# EAGLE schematic SIMBA_System_Control_PCB v38 (EAGLE 9.7.0), part 1 of 3
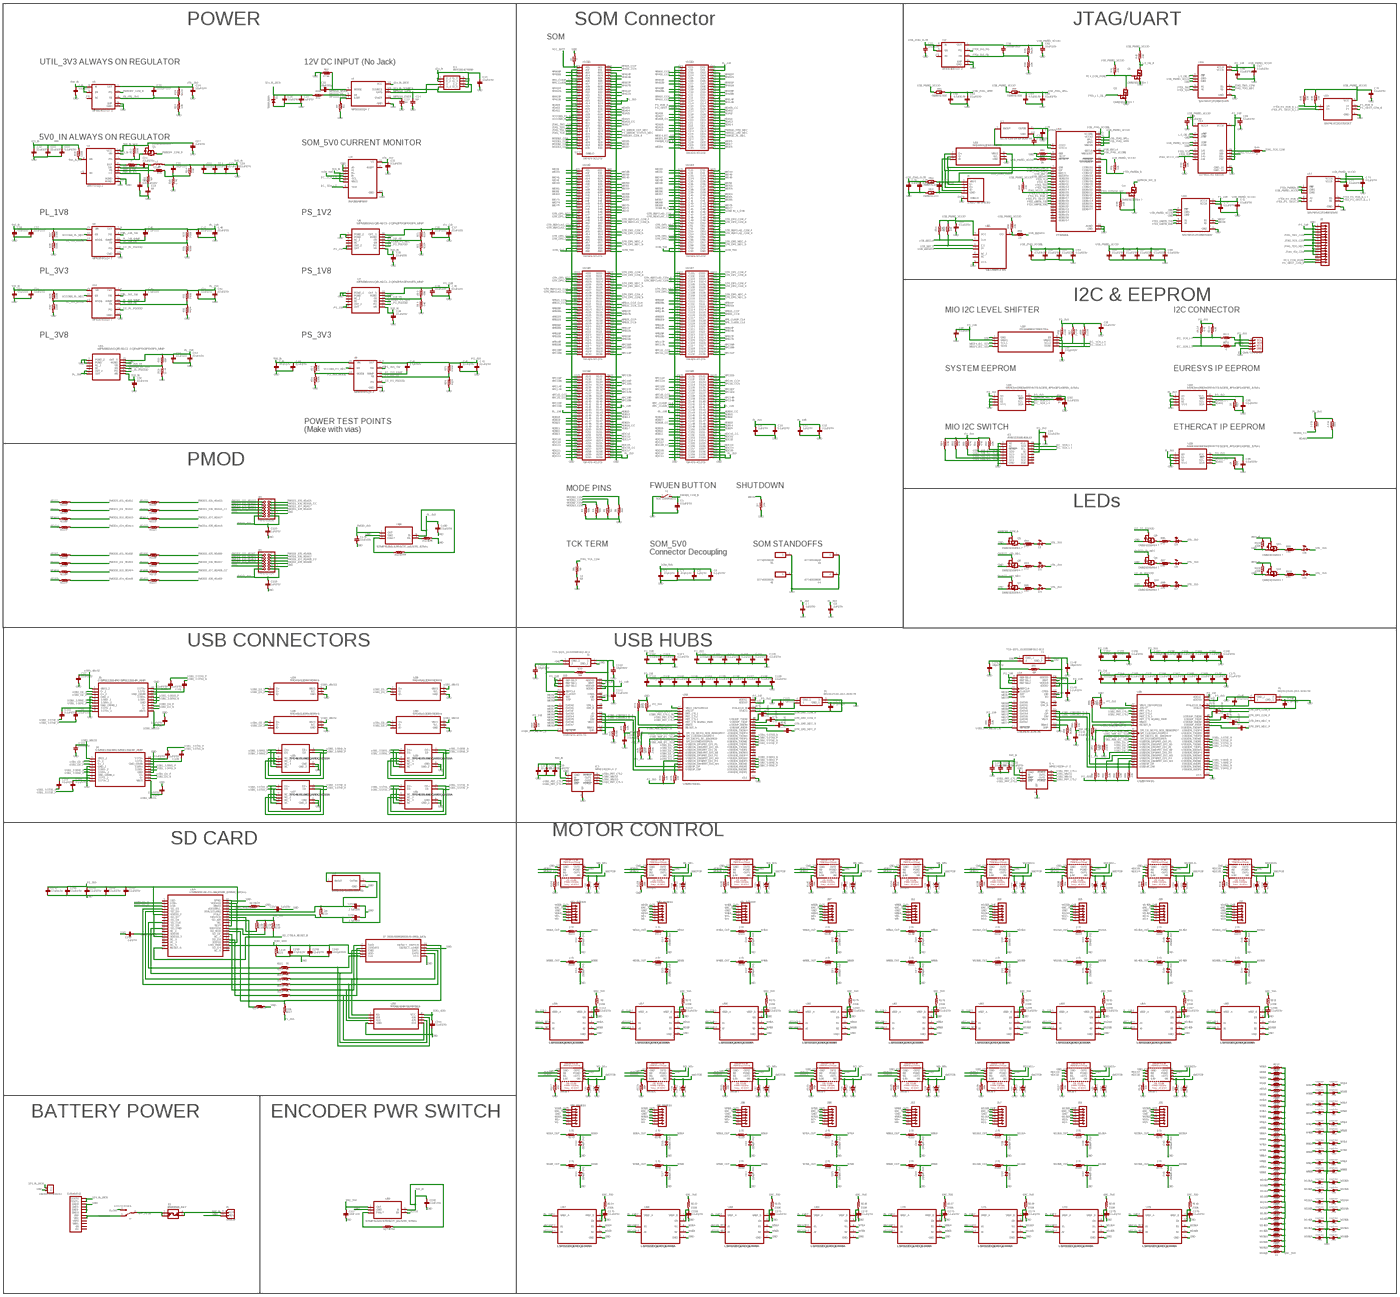
[diagram p0: schematic, sheet 1, overview]
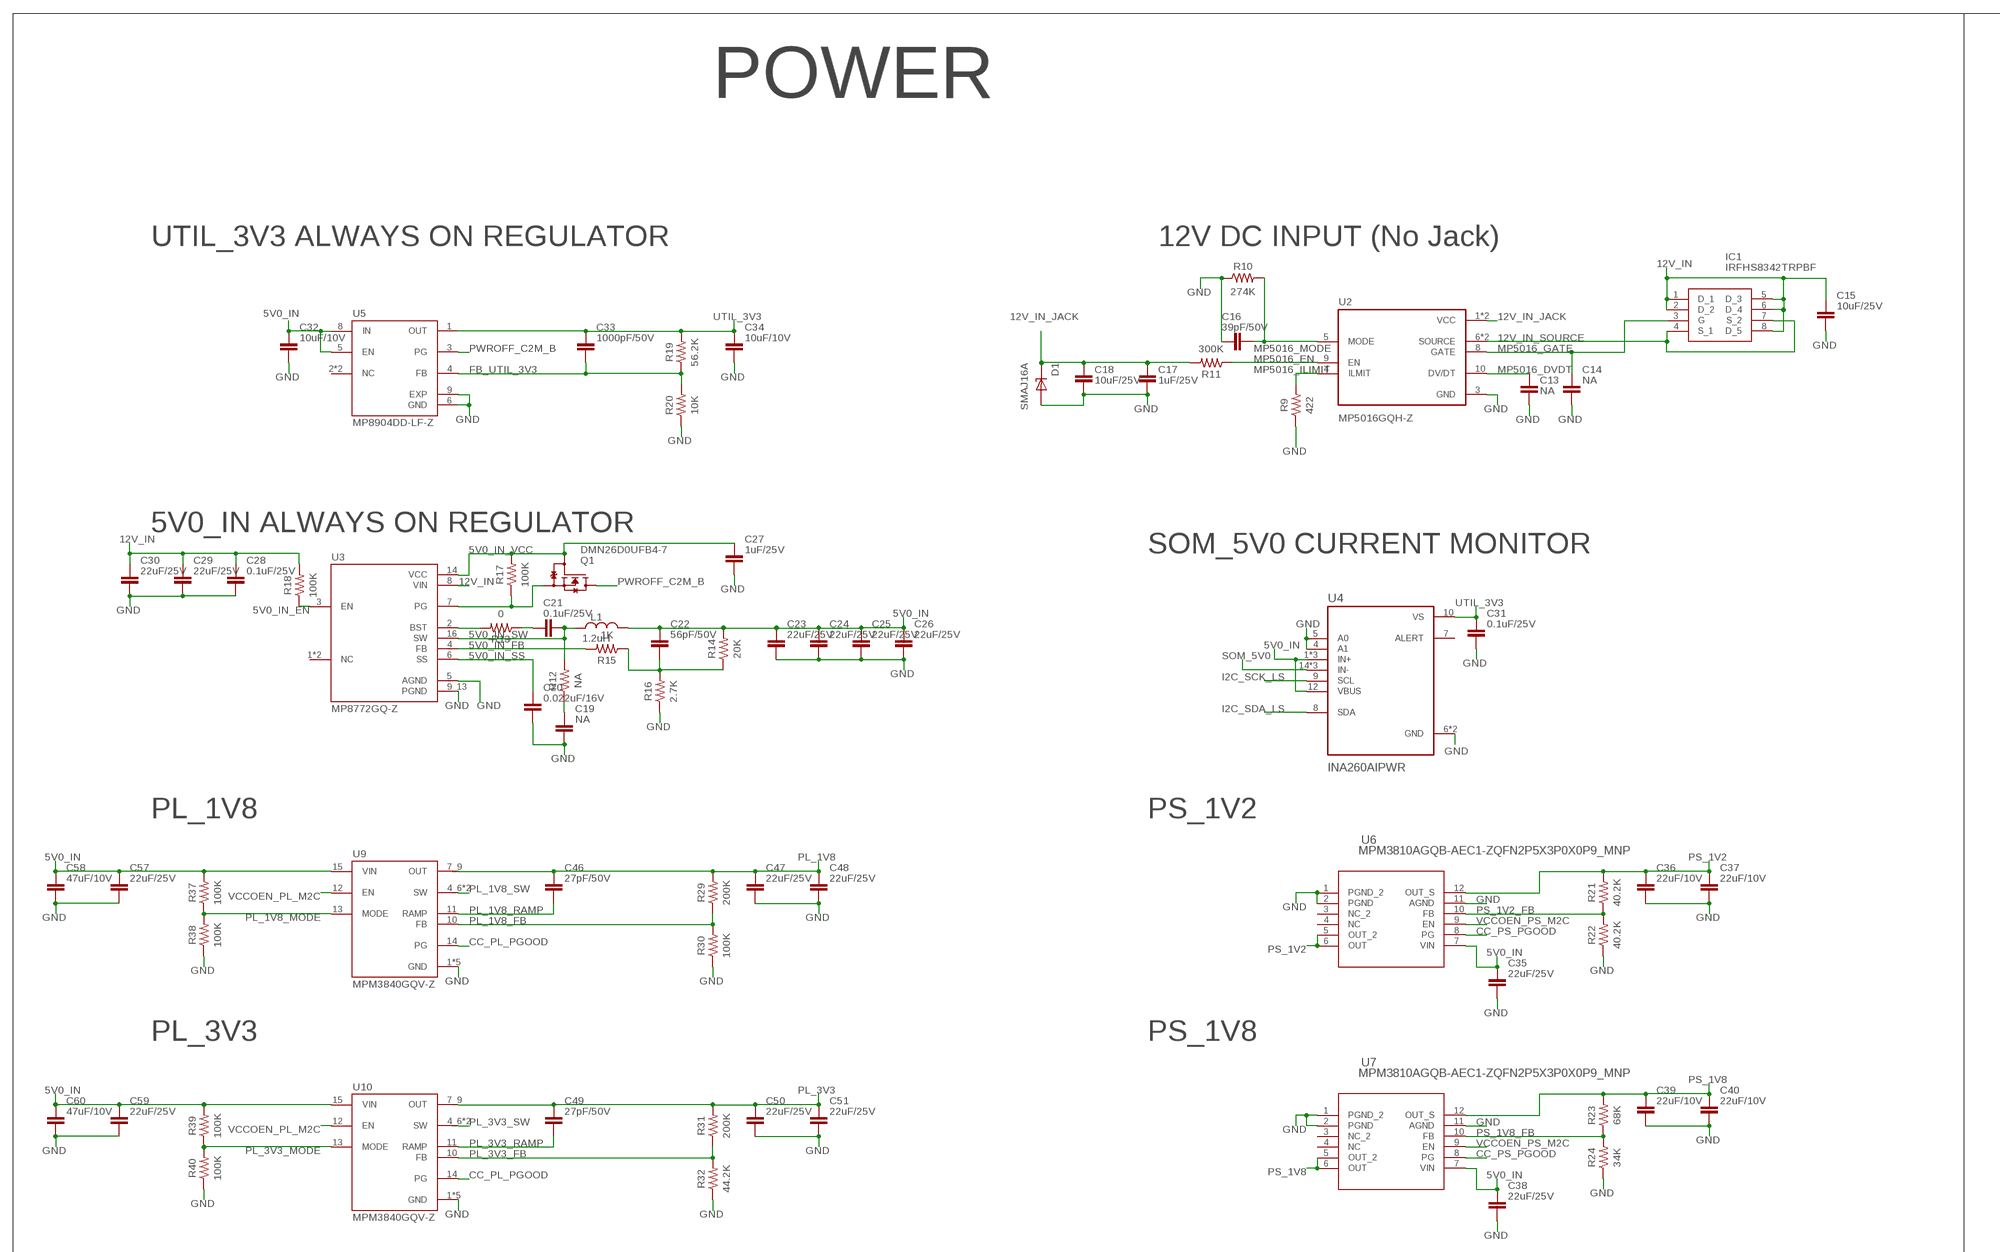
[diagram p1: schematic, sheet 1, part 1 of 9]
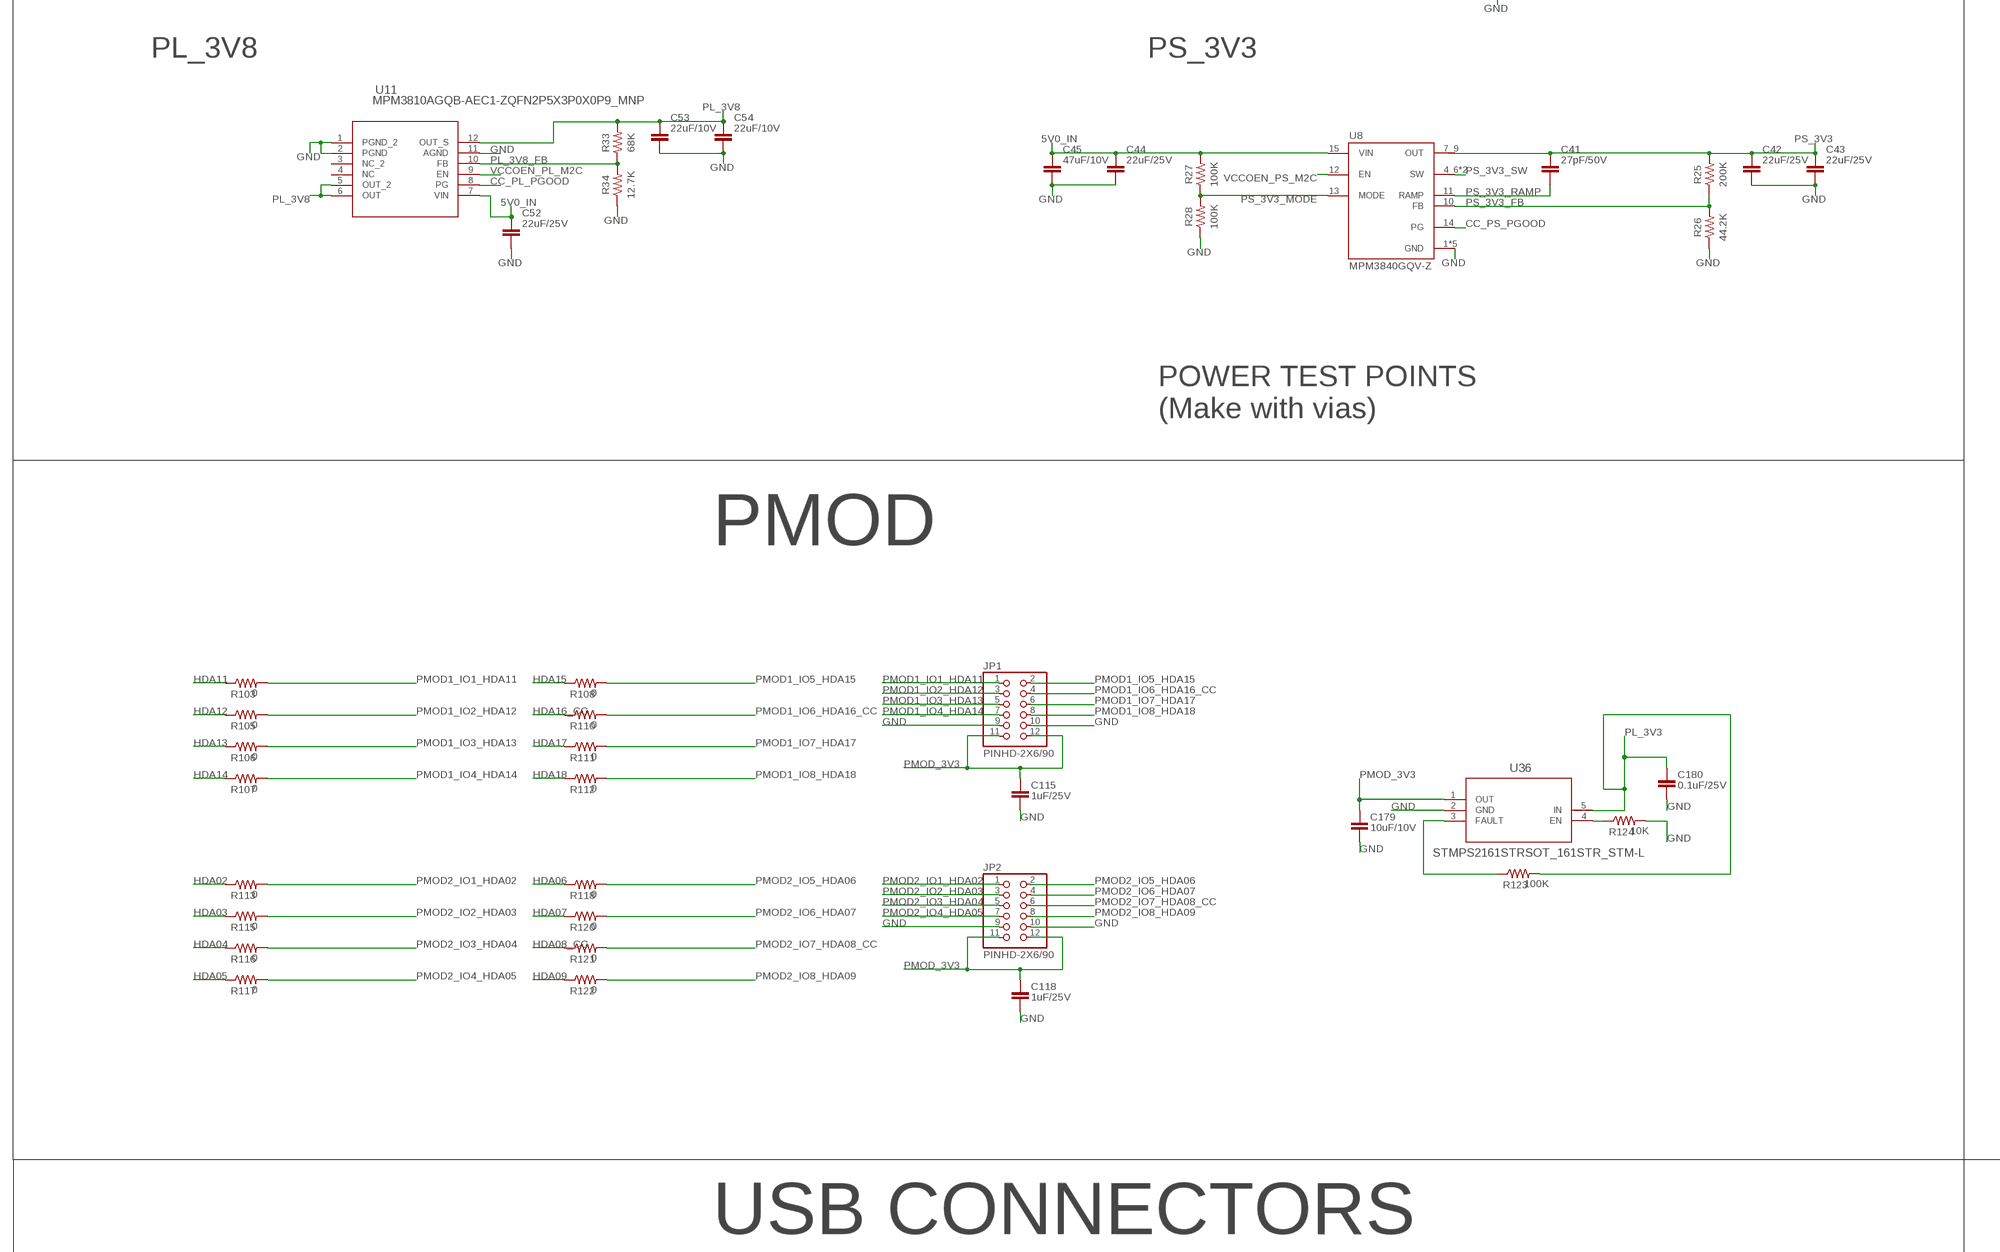
[diagram p2: schematic, sheet 1, part 2 of 9]
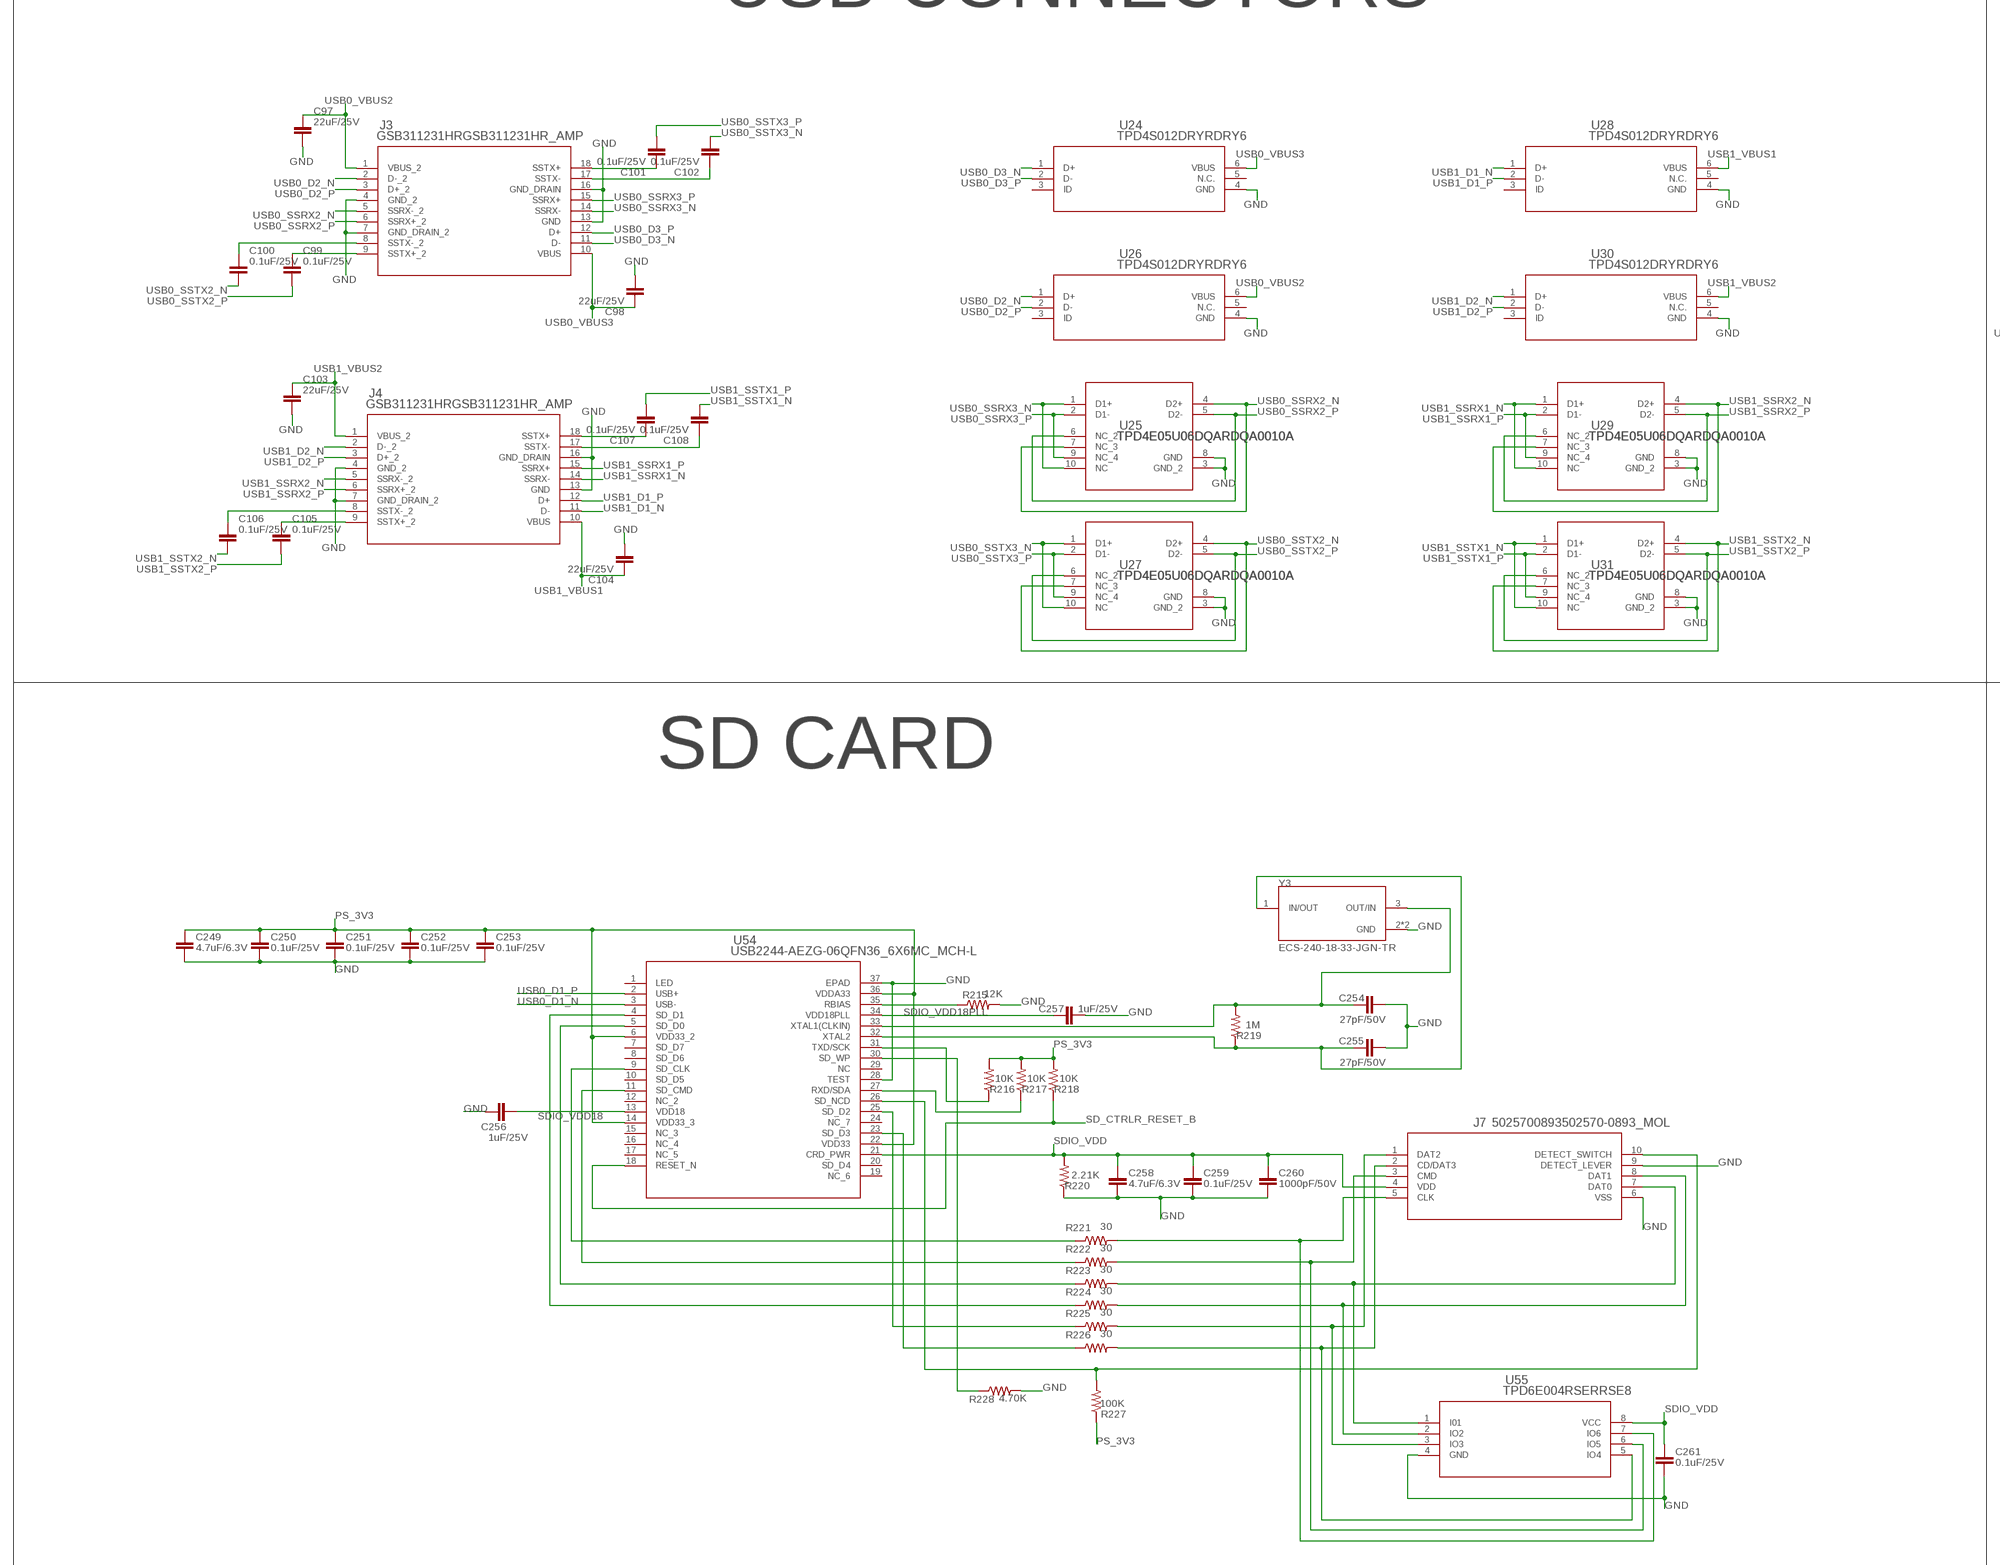
[diagram p3: schematic, sheet 1, part 3 of 9]
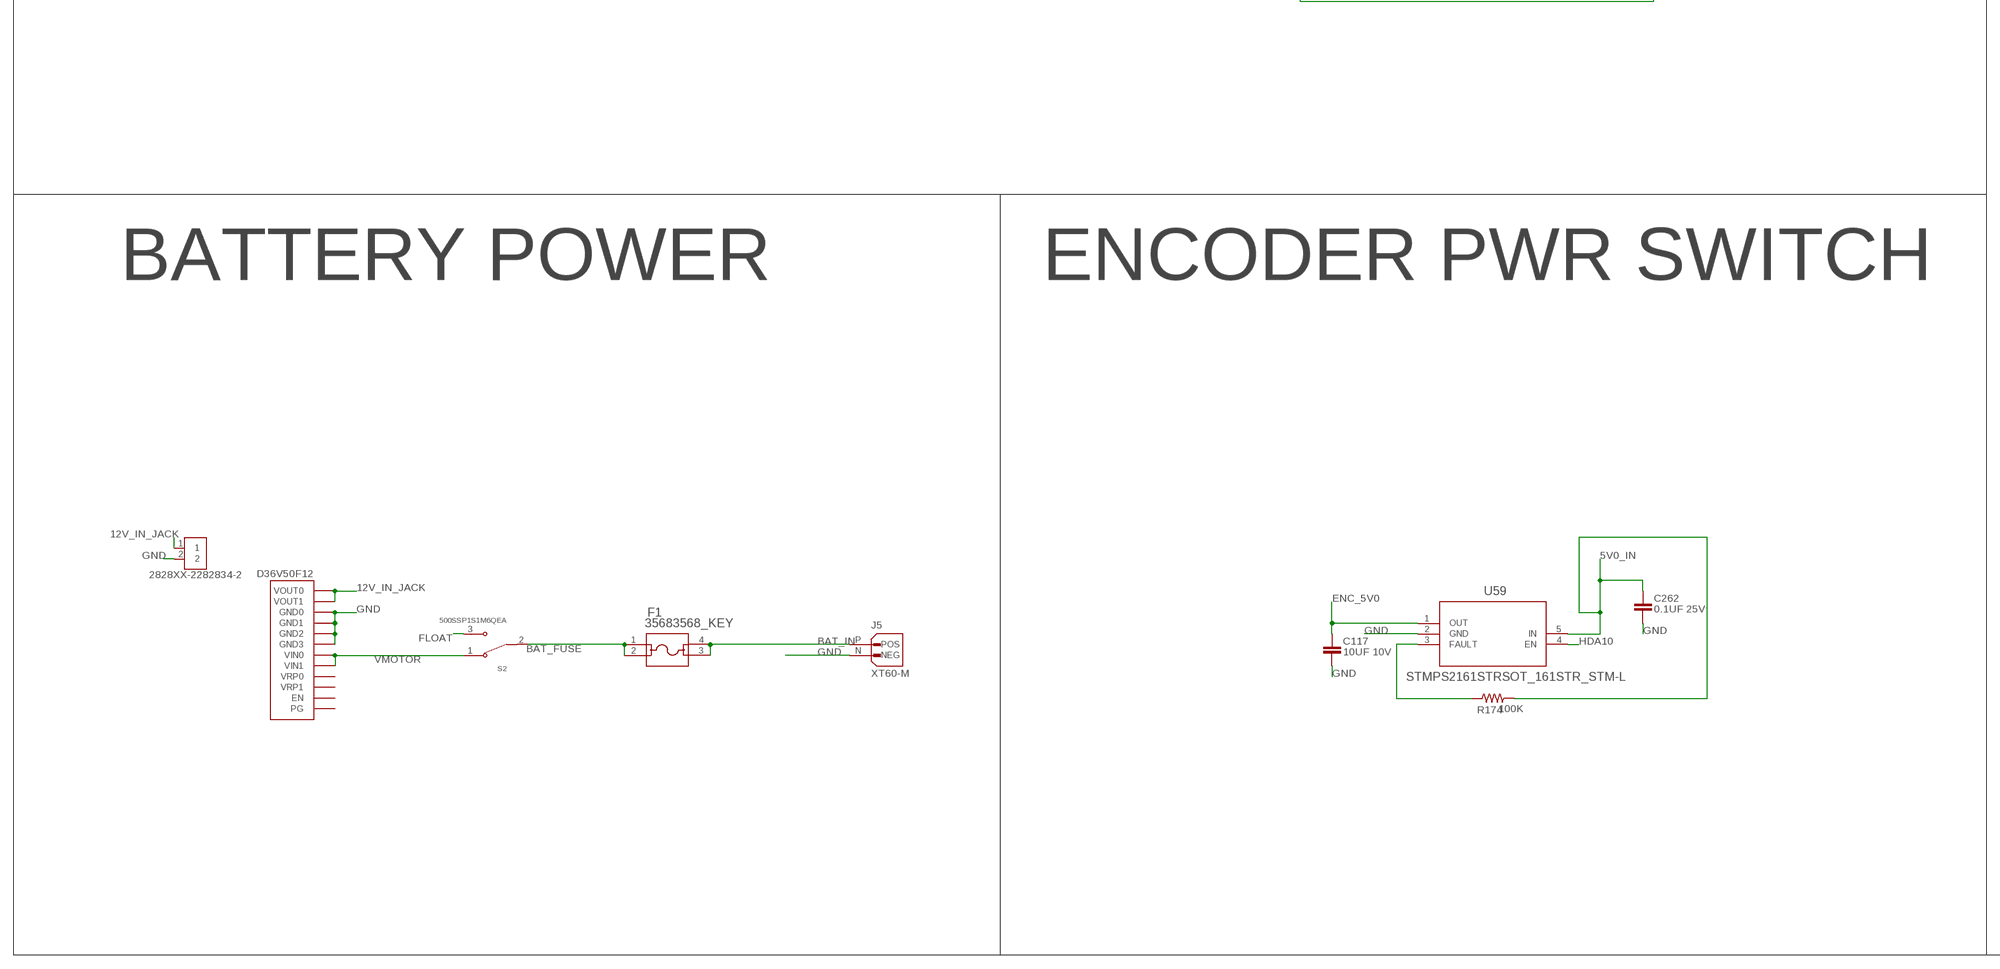
[diagram p4: schematic, sheet 1, part 4 of 9]
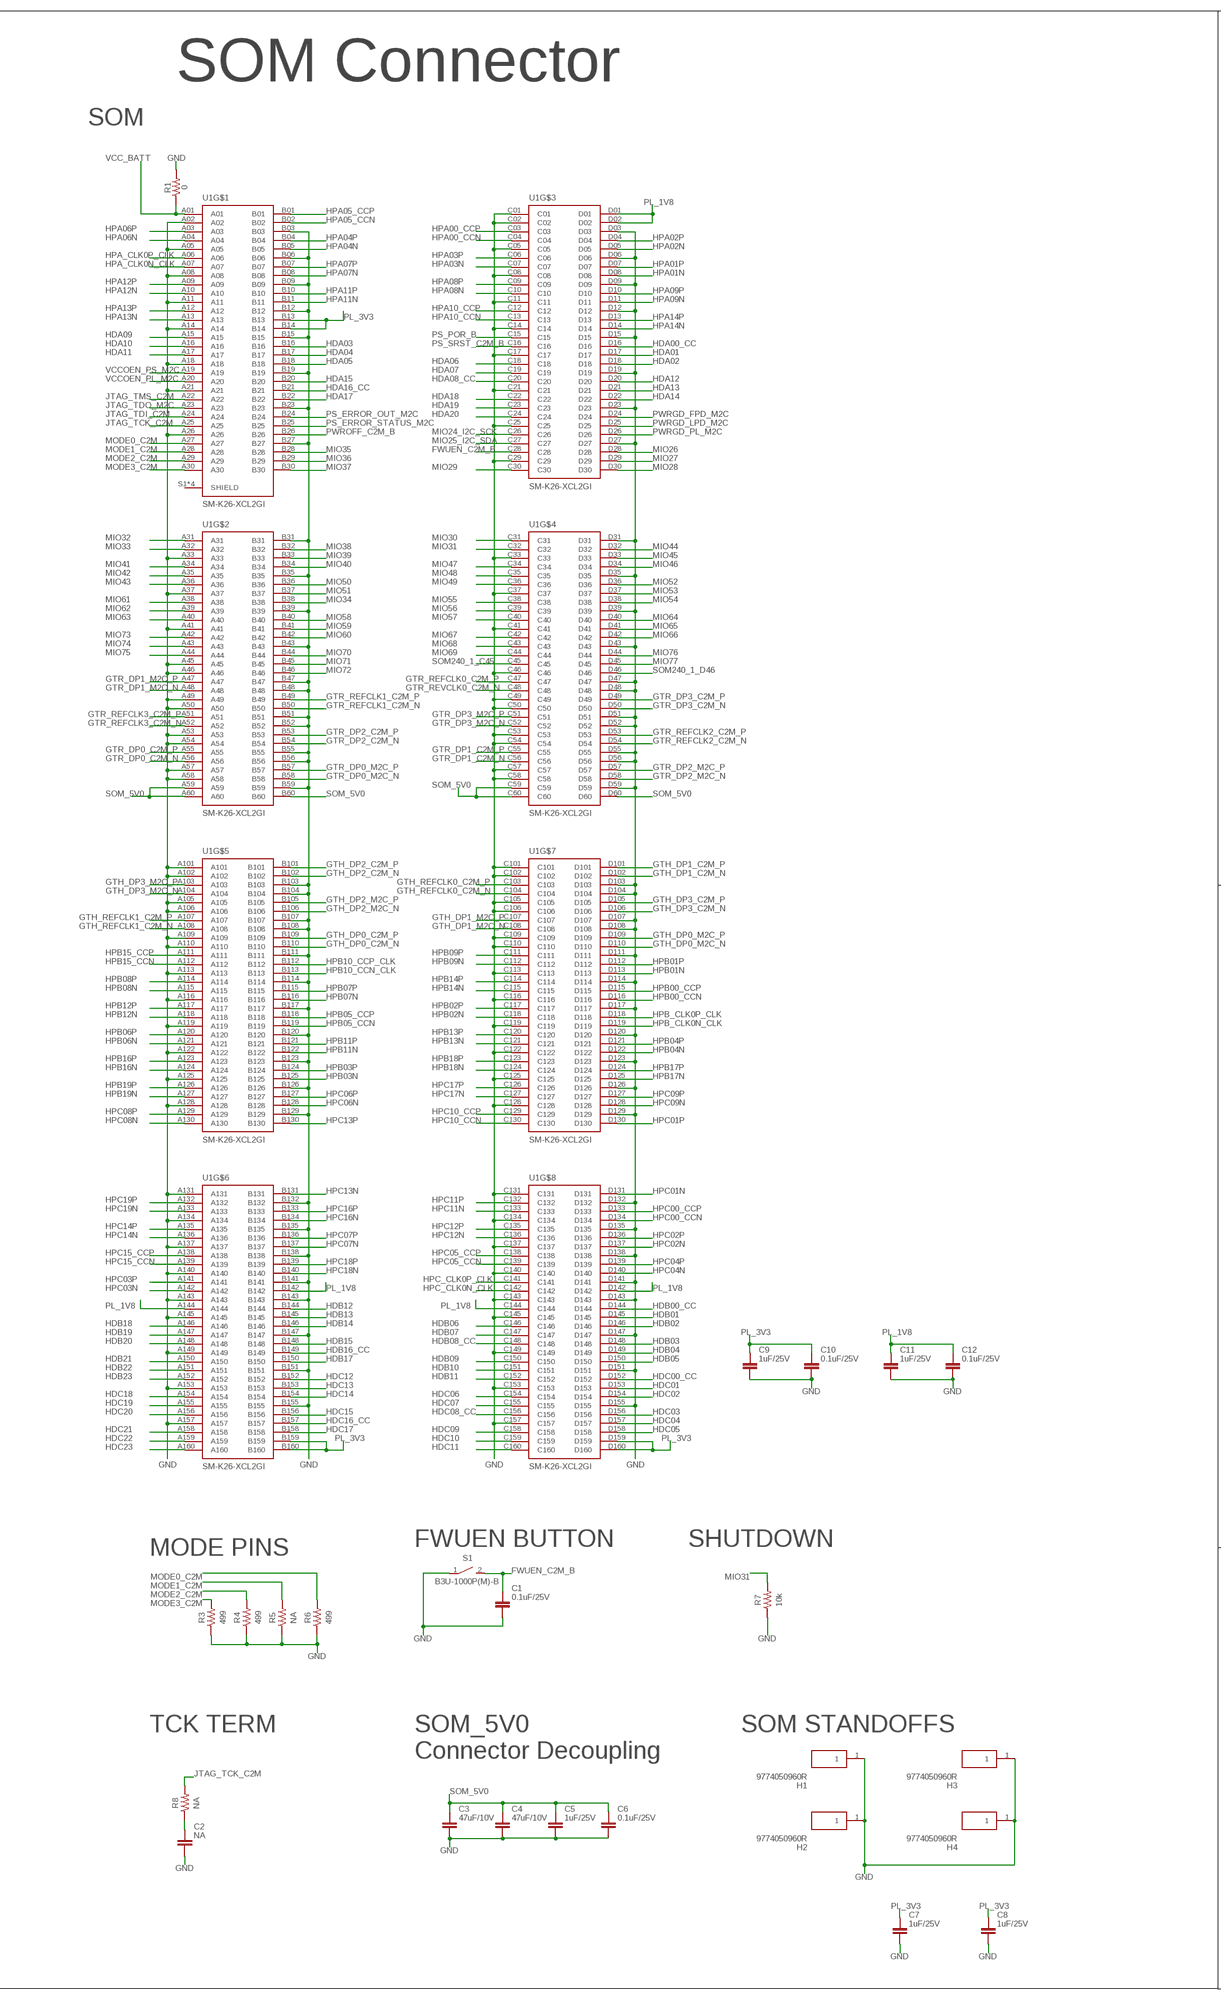
[diagram p5: schematic, sheet 1, part 5 of 9]
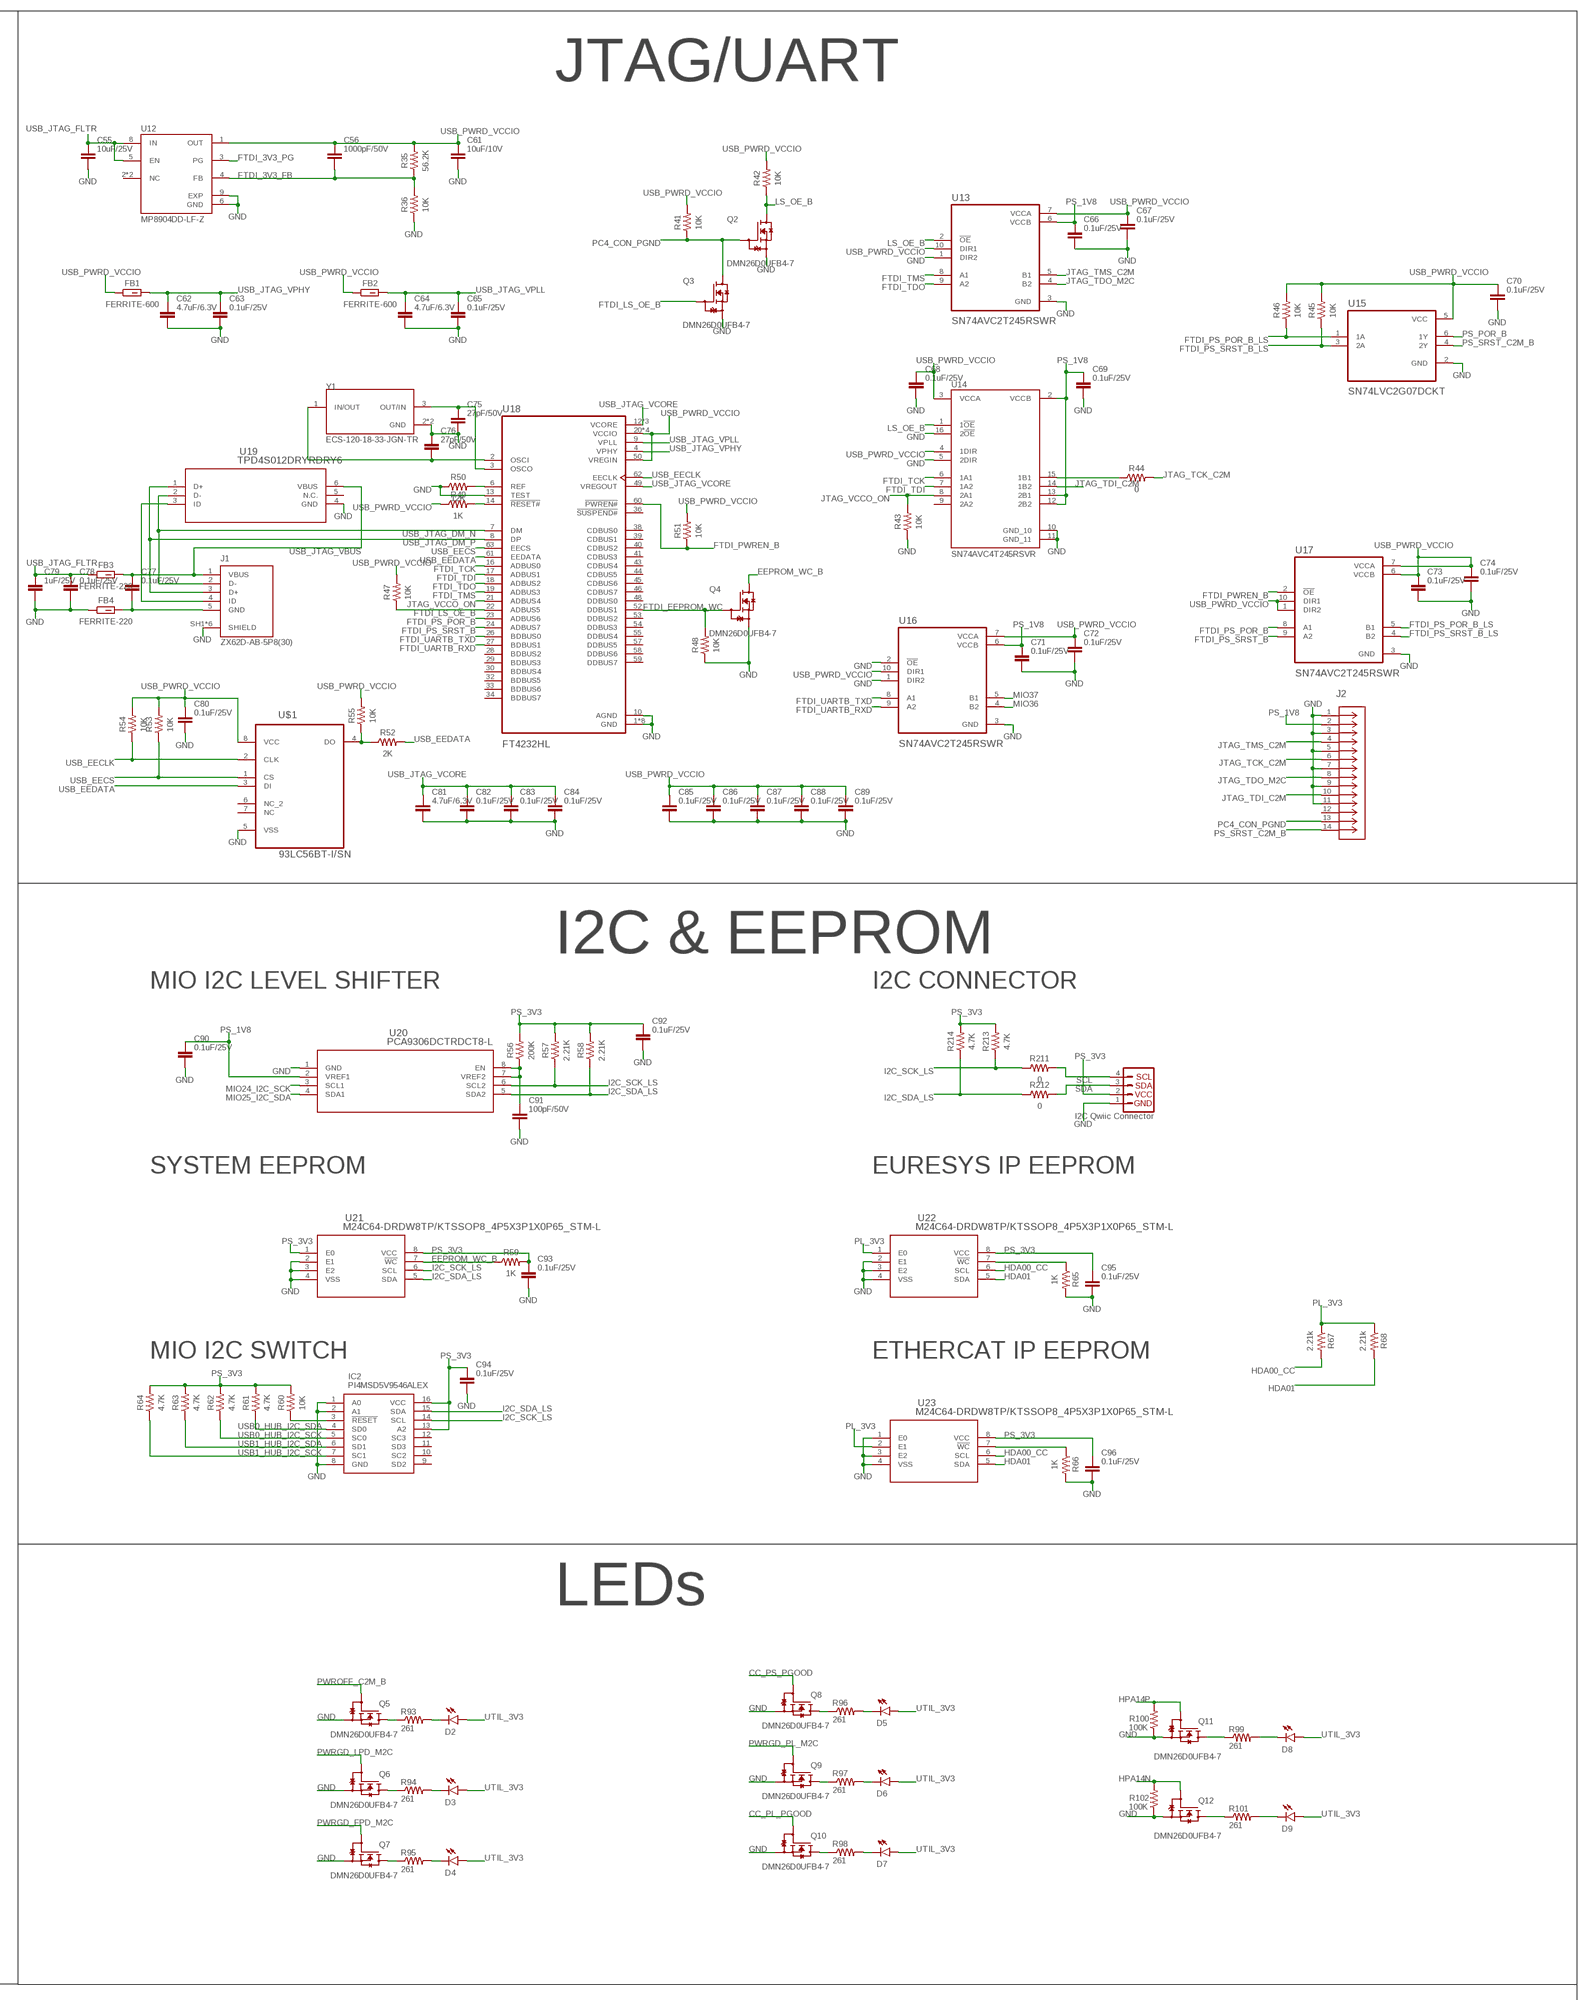
[diagram p6: schematic, sheet 1, part 6 of 9]
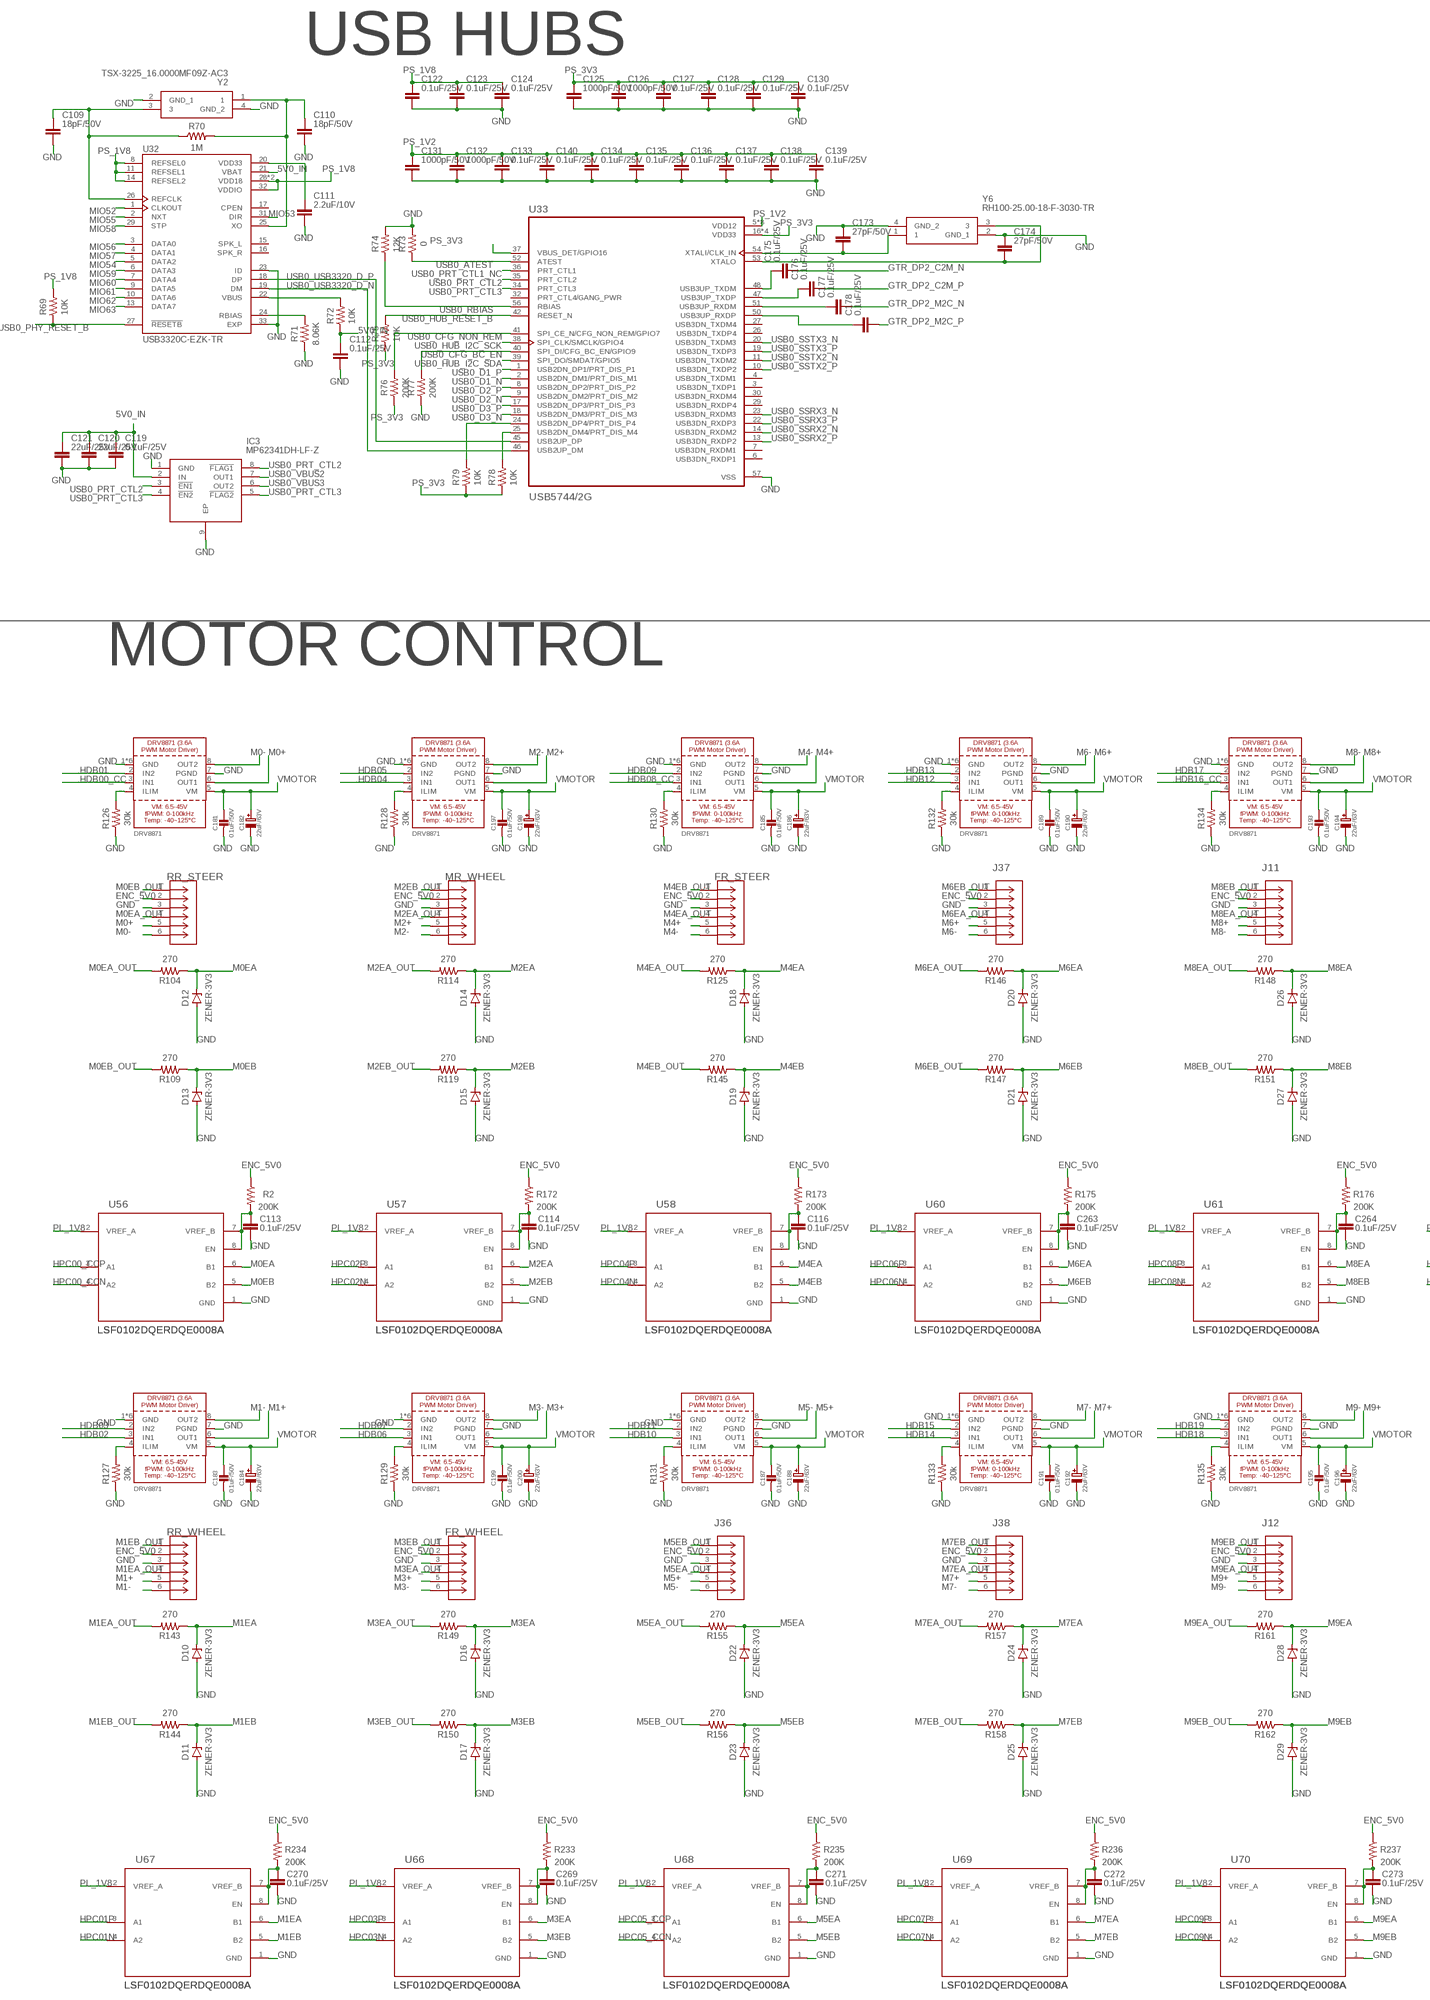
[diagram p7: schematic, sheet 1, part 7 of 9]
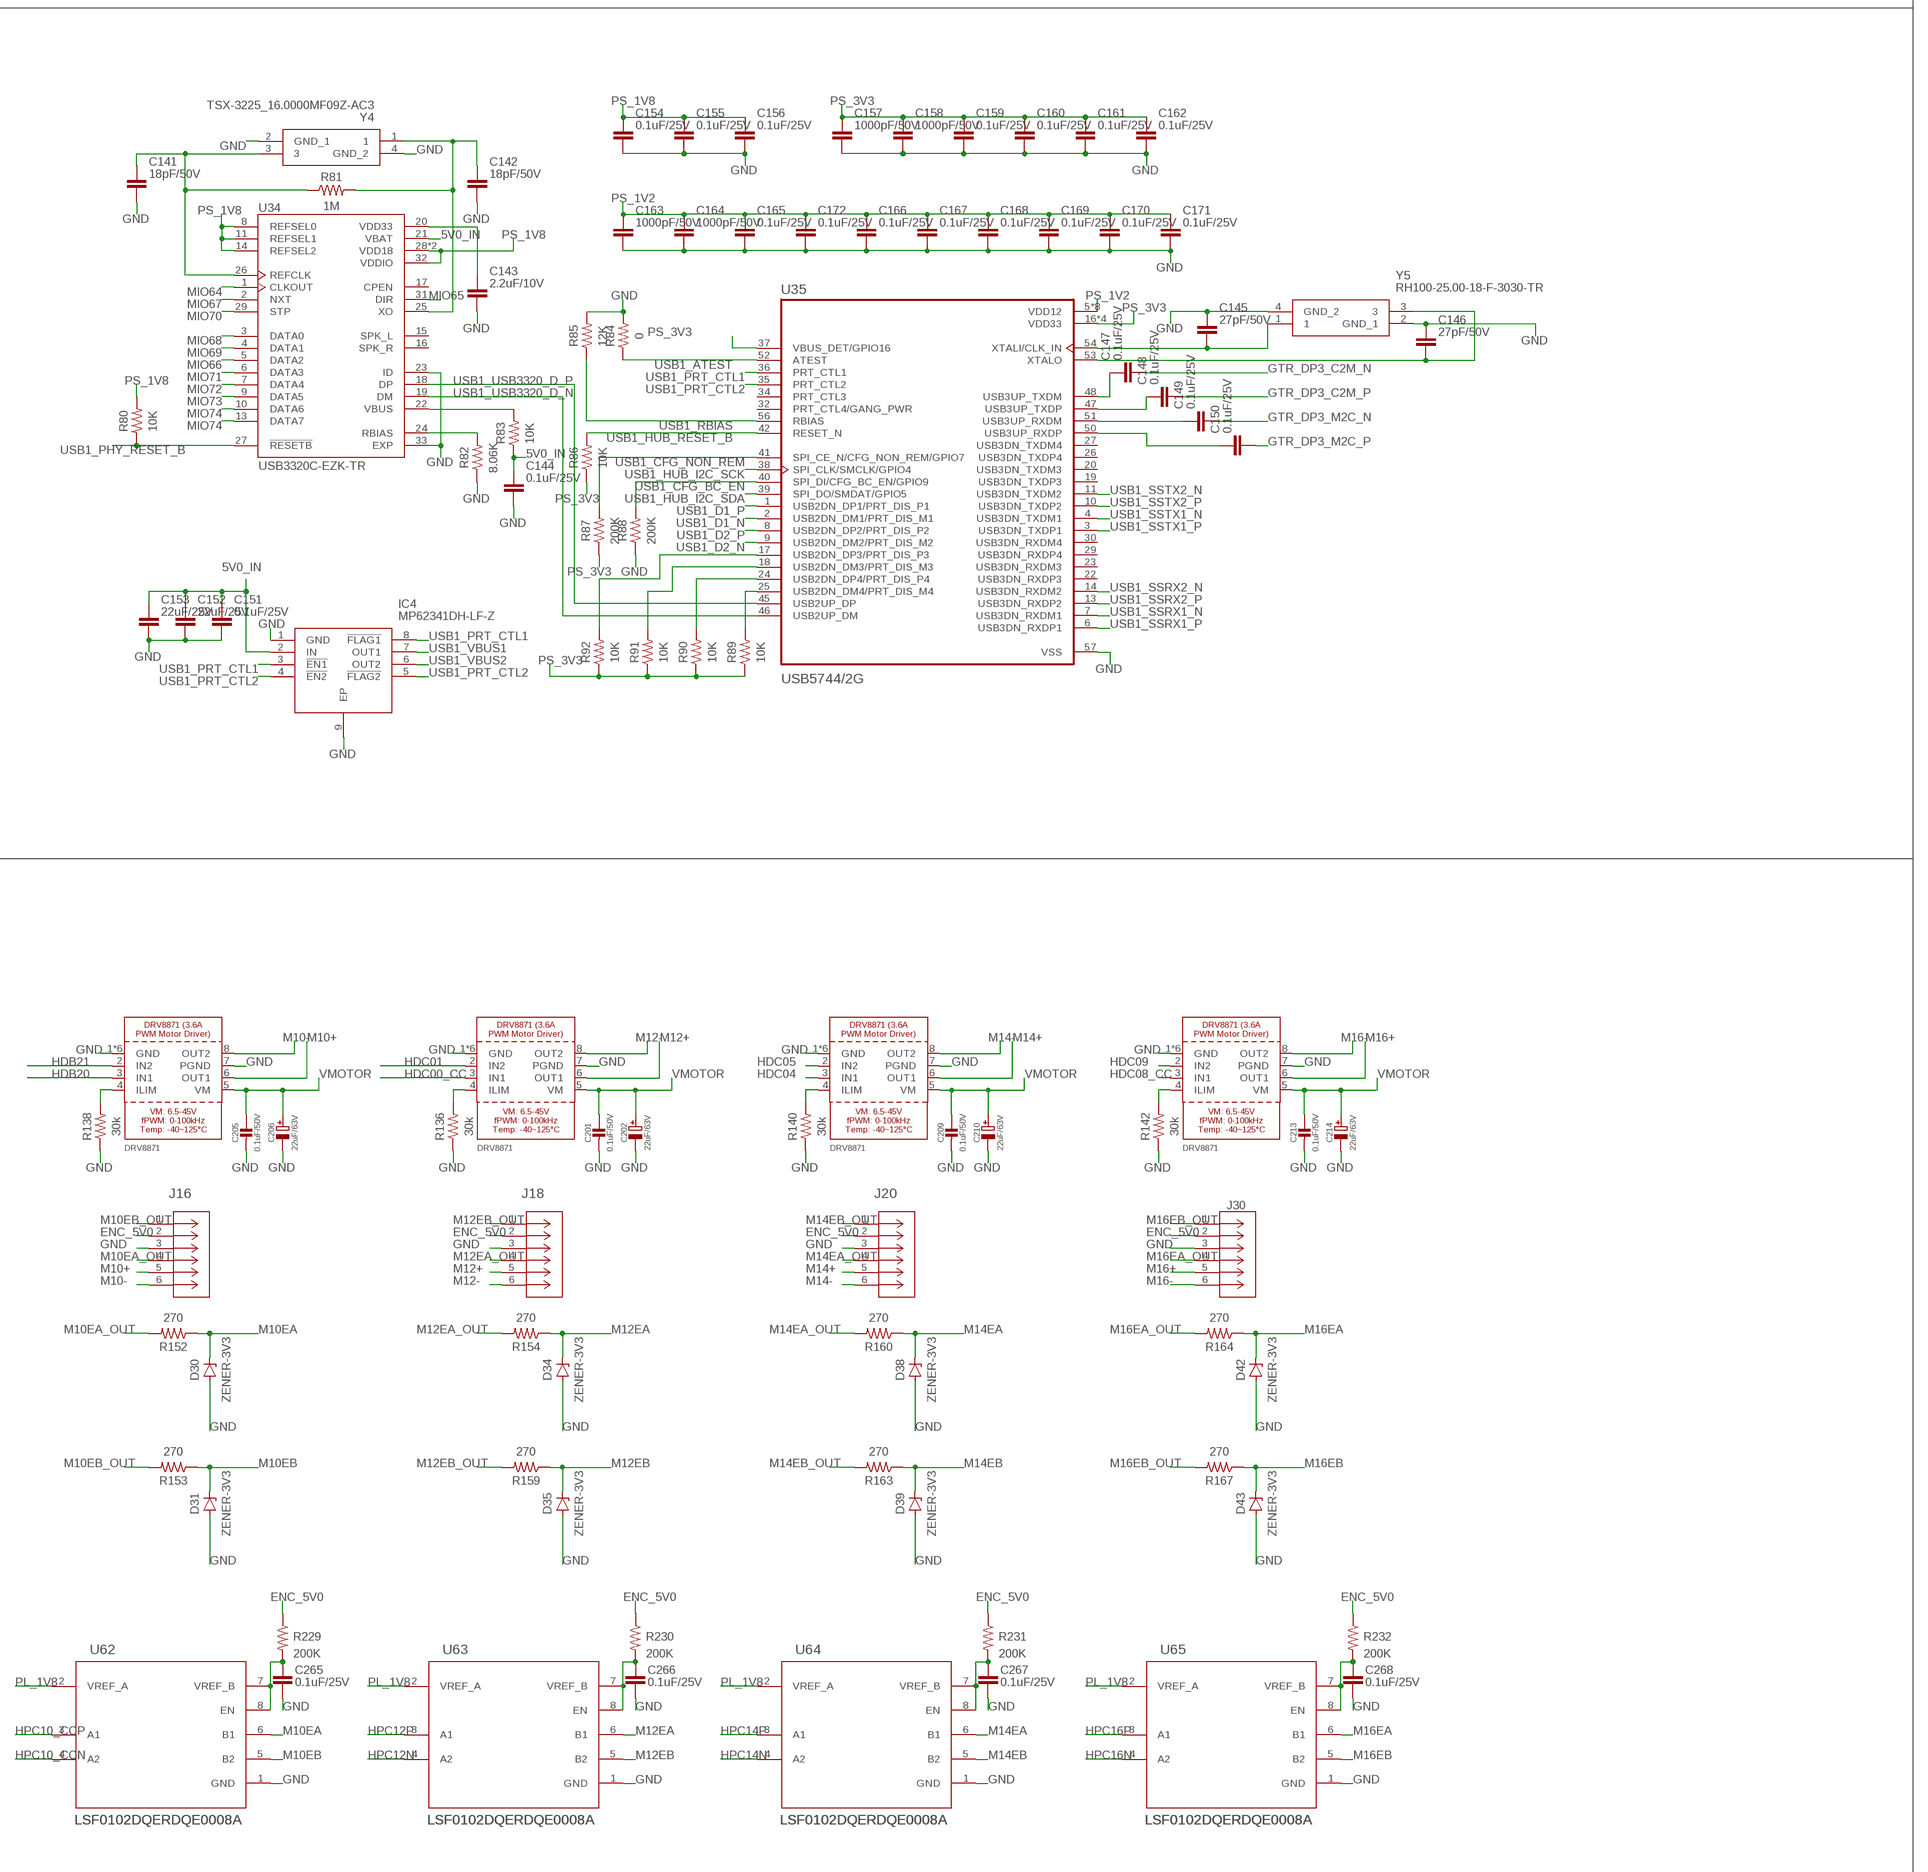
[diagram p8: schematic, sheet 1, part 8 of 9]
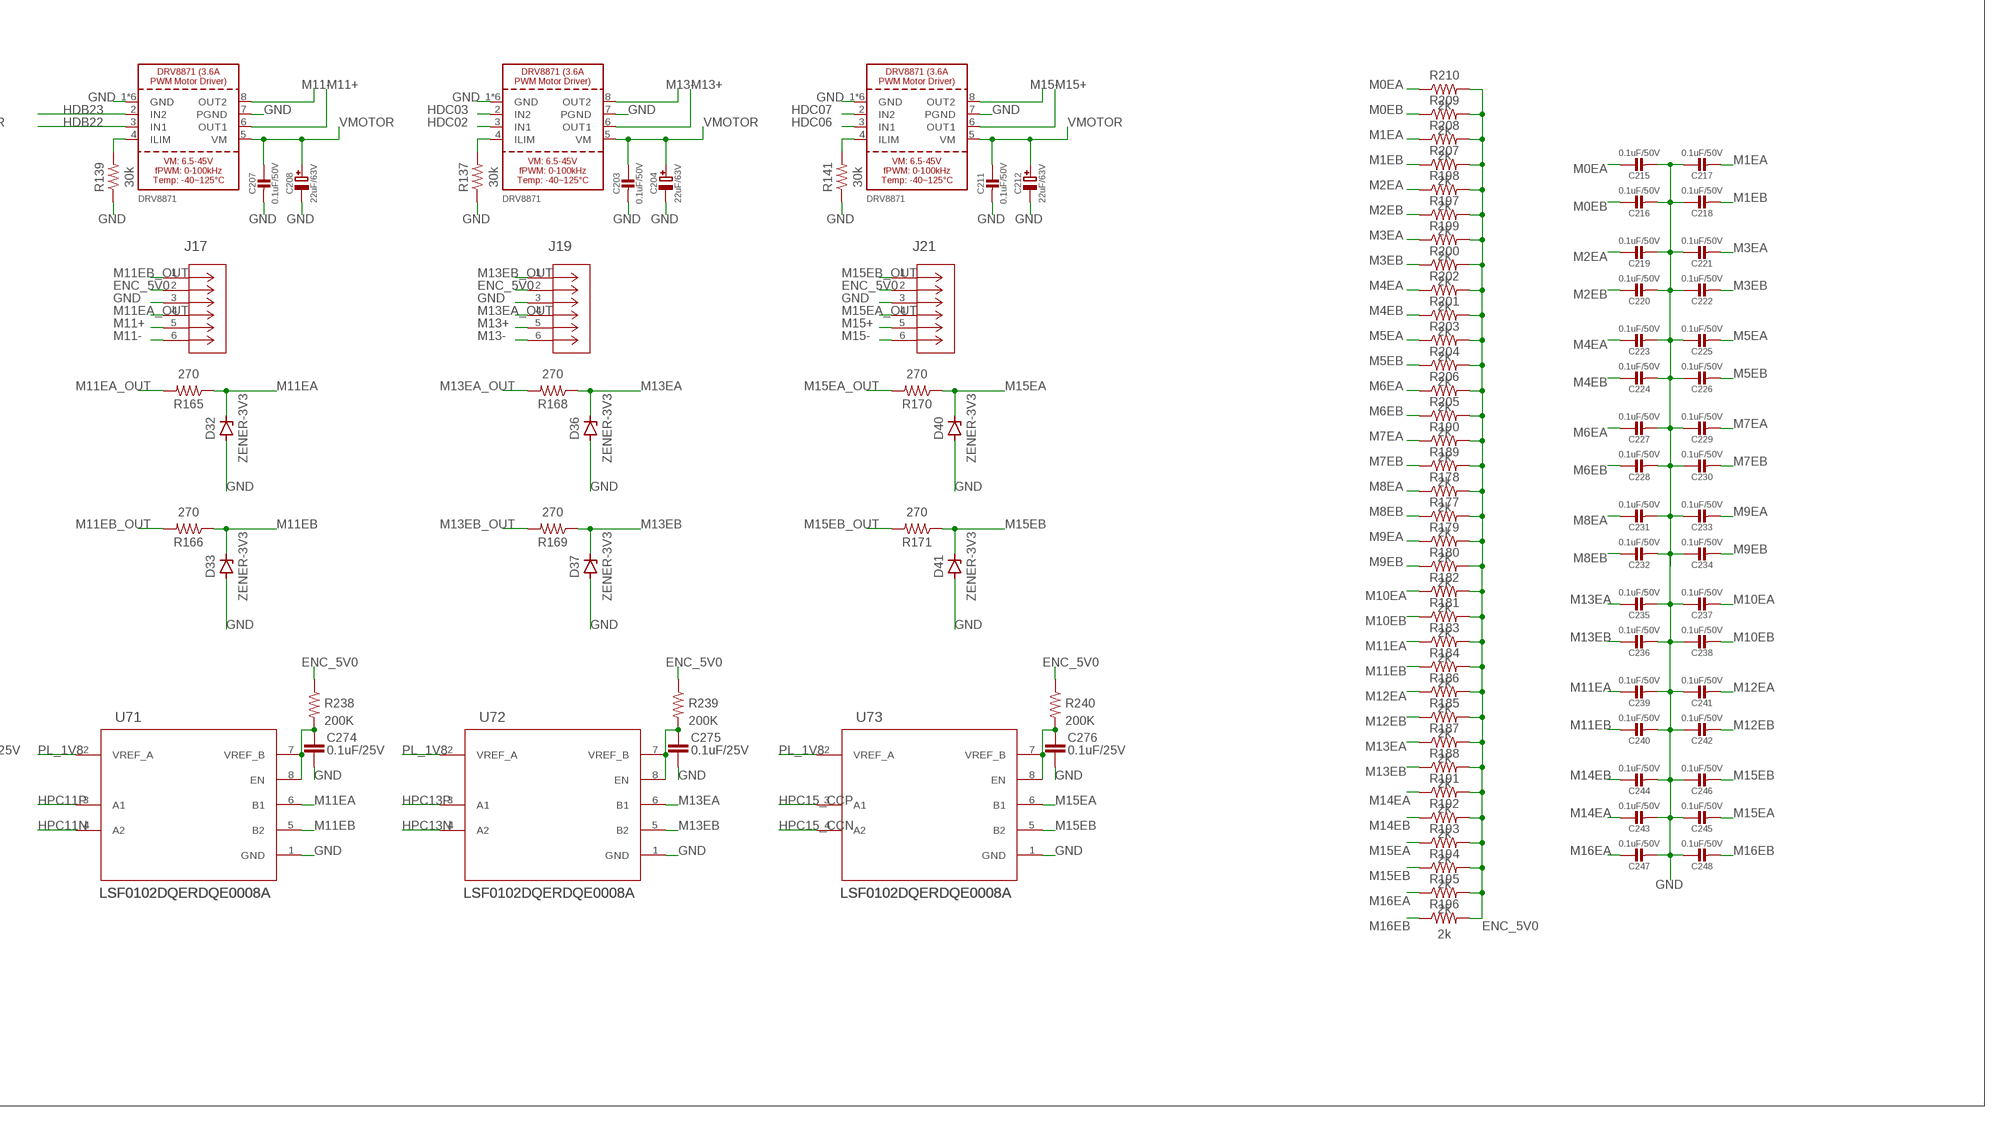
[diagram p9: schematic, sheet 1, part 9 of 9]

## Parts
C1  0.1uF/25V  C_CHIP-0805(2012-METRIC)  [CAPC2012X110]
C2  NA  C_CHIP-0805(2012-METRIC)  [CAPC2012X110]
C3  47uF/10V  C_CHIP-0805(2012-METRIC)  [CAPC2012X110]
C4  47uF/10V  C_CHIP-0805(2012-METRIC)  [CAPC2012X110]
C5  1uF/25V  C_CHIP-0805(2012-METRIC)  [CAPC2012X110]
C6  0.1uF/25V  C_CHIP-0805(2012-METRIC)  [CAPC2012X110]
C7  1uF/25V  C_CHIP-0805(2012-METRIC)  [CAPC2012X110]
C8  1uF/25V  C_CHIP-0805(2012-METRIC)  [CAPC2012X110]
C9  1uF/25V  C_CHIP-0805(2012-METRIC)  [CAPC2012X110]
C10  0.1uF/25V  C_CHIP-0805(2012-METRIC)  [CAPC2012X110]
C11  1uF/25V  C_CHIP-0805(2012-METRIC)  [CAPC2012X110]
C12  0.1uF/25V  C_CHIP-0805(2012-METRIC)  [CAPC2012X110]
C13  NA  C_CHIP-0805(2012-METRIC)  [CAPC2012X110]
C14  NA  C_CHIP-0805(2012-METRIC)  [CAPC2012X110]
C15  10uF/25V  C_CHIP-0805(2012-METRIC)  [CAPC2012X110]
C16  39pF/50V  C_CHIP-0805(2012-METRIC)  [CAPC2012X110]
C17  1uF/25V  C_CHIP-0805(2012-METRIC)  [CAPC2012X110]
C18  10uF/25V  C_CHIP-0805(2012-METRIC)  [CAPC2012X110]
C19  NA  C_CHIP-0805(2012-METRIC)  [CAPC2012X110]
C20  0.022uF/16V  C_CHIP-0805(2012-METRIC)  [CAPC2012X110]
C21  0.1uF/25V  C_CHIP-0805(2012-METRIC)  [CAPC2012X110]
C22  56pF/50V  C_CHIP-0805(2012-METRIC)  [CAPC2012X110]
C23  22uF/25V  C_CHIP-0805(2012-METRIC)  [CAPC2012X110]
C24  22uF/25V  C_CHIP-0805(2012-METRIC)  [CAPC2012X110]
C25  22uF/25V  C_CHIP-0805(2012-METRIC)  [CAPC2012X110]
C26  22uF/25V  C_CHIP-0805(2012-METRIC)  [CAPC2012X110]
C27  1uF/25V  C_CHIP-0805(2012-METRIC)  [CAPC2012X110]
C28  0.1uF/25V  C_CHIP-0805(2012-METRIC)  [CAPC2012X110]
C29  22uF/25V  C_CHIP-0805(2012-METRIC)  [CAPC2012X110]
C30  22uF/25V  C_CHIP-0805(2012-METRIC)  [CAPC2012X110]
C31  0.1uF/25V  C_CHIP-0805(2012-METRIC)  [CAPC2012X110]
C32  10uF/10V  C_CHIP-0805(2012-METRIC)  [CAPC2012X110]
C33  1000pF/50V  C_CHIP-0805(2012-METRIC)  [CAPC2012X110]
C34  10uF/10V  C_CHIP-0805(2012-METRIC)  [CAPC2012X110]
C35  22uF/25V  C_CHIP-0805(2012-METRIC)  [CAPC2012X110]
C36  22uF/10V  C_CHIP-0805(2012-METRIC)  [CAPC2012X110]
C37  22uF/10V  C_CHIP-0805(2012-METRIC)  [CAPC2012X110]
C38  22uF/25V  C_CHIP-0805(2012-METRIC)  [CAPC2012X110]
C39  22uF/10V  C_CHIP-0805(2012-METRIC)  [CAPC2012X110]
C40  22uF/10V  C_CHIP-0805(2012-METRIC)  [CAPC2012X110]
C41  27pF/50V  C_CHIP-0805(2012-METRIC)  [CAPC2012X110]
C42  22uF/25V  C_CHIP-0805(2012-METRIC)  [CAPC2012X110]
C43  22uF/25V  C_CHIP-0805(2012-METRIC)  [CAPC2012X110]
C44  22uF/25V  C_CHIP-0805(2012-METRIC)  [CAPC2012X110]
C45  47uF/10V  C_CHIP-0805(2012-METRIC)  [CAPC2012X110]
C46  27pF/50V  C_CHIP-0805(2012-METRIC)  [CAPC2012X110]
C47  22uF/25V  C_CHIP-0805(2012-METRIC)  [CAPC2012X110]
C48  22uF/25V  C_CHIP-0805(2012-METRIC)  [CAPC2012X110]
C49  27pF/50V  C_CHIP-0805(2012-METRIC)  [CAPC2012X110]
C50  22uF/25V  C_CHIP-0805(2012-METRIC)  [CAPC2012X110]
C51  22uF/25V  C_CHIP-0805(2012-METRIC)  [CAPC2012X110]
C52  22uF/25V  C_CHIP-0805(2012-METRIC)  [CAPC2012X110]
C53  22uF/10V  C_CHIP-0805(2012-METRIC)  [CAPC2012X110]
C54  22uF/10V  C_CHIP-0805(2012-METRIC)  [CAPC2012X110]
C55  10uF/25V  C_CHIP-0805(2012-METRIC)  [CAPC2012X110]
C56  1000pF/50V  C_CHIP-0805(2012-METRIC)  [CAPC2012X110]
C57  22uF/25V  C_CHIP-0805(2012-METRIC)  [CAPC2012X110]
C58  47uF/10V  C_CHIP-0805(2012-METRIC)  [CAPC2012X110]
C59  22uF/25V  C_CHIP-0805(2012-METRIC)  [CAPC2012X110]
C60  47uF/10V  C_CHIP-0805(2012-METRIC)  [CAPC2012X110]
C61  10uF/10V  C_CHIP-0805(2012-METRIC)  [CAPC2012X110]
C62  4.7uF/6.3V  C_CHIP-0805(2012-METRIC)  [CAPC2012X110]
C63  0.1uF/25V  C_CHIP-0805(2012-METRIC)  [CAPC2012X110]
C64  4.7uF/6.3V  C_CHIP-0805(2012-METRIC)  [CAPC2012X110]
C65  0.1uF/25V  C_CHIP-0805(2012-METRIC)  [CAPC2012X110]
C66  0.1uF/25V  C_CHIP-0805(2012-METRIC)  [CAPC2012X110]
C67  0.1uF/25V  C_CHIP-0805(2012-METRIC)  [CAPC2012X110]
C68  0.1uF/25V  C_CHIP-0805(2012-METRIC)  [CAPC2012X110]
C69  0.1uF/25V  C_CHIP-0805(2012-METRIC)  [CAPC2012X110]
C70  0.1uF/25V  C_CHIP-0805(2012-METRIC)  [CAPC2012X110]
C71  0.1uF/25V  C_CHIP-0805(2012-METRIC)  [CAPC2012X110]
C72  0.1uF/25V  C_CHIP-0805(2012-METRIC)  [CAPC2012X110]
C73  0.1uF/25V  C_CHIP-0805(2012-METRIC)  [CAPC2012X110]
C74  0.1uF/25V  C_CHIP-0805(2012-METRIC)  [CAPC2012X110]
C75  27pF/50V  C_CHIP-0805(2012-METRIC)  [CAPC2012X110]
C76  27pF/50V  C_CHIP-0805(2012-METRIC)  [CAPC2012X110]
C77  0.1uF/25V  C_CHIP-0805(2012-METRIC)  [CAPC2012X110]
C78  0.1uF/25V  C_CHIP-0805(2012-METRIC)  [CAPC2012X110]
C79  1uF/25V  C_CHIP-0805(2012-METRIC)  [CAPC2012X110]
C80  0.1uF/25V  C_CHIP-0805(2012-METRIC)  [CAPC2012X110]
C81  4.7uF/6.3V  C_CHIP-0805(2012-METRIC)  [CAPC2012X110]
C82  0.1uF/25V  C_CHIP-0805(2012-METRIC)  [CAPC2012X110]
C83  0.1uF/25V  C_CHIP-0805(2012-METRIC)  [CAPC2012X110]
C84  0.1uF/25V  C_CHIP-0805(2012-METRIC)  [CAPC2012X110]
C85  0.1uF/25V  C_CHIP-0805(2012-METRIC)  [CAPC2012X110]
C86  0.1uF/25V  C_CHIP-0805(2012-METRIC)  [CAPC2012X110]
C87  0.1uF/25V  C_CHIP-0805(2012-METRIC)  [CAPC2012X110]
C88  0.1uF/25V  C_CHIP-0805(2012-METRIC)  [CAPC2012X110]
C89  0.1uF/25V  C_CHIP-0805(2012-METRIC)  [CAPC2012X110]
C90  0.1uF/25V  C_CHIP-0805(2012-METRIC)  [CAPC2012X110]
C91  100pF/50V  C_CHIP-0805(2012-METRIC)  [CAPC2012X110]
C92  0.1uF/25V  C_CHIP-0805(2012-METRIC)  [CAPC2012X110]
C93  0.1uF/25V  C_CHIP-0805(2012-METRIC)  [CAPC2012X110]
C94  0.1uF/25V  C_CHIP-0805(2012-METRIC)  [CAPC2012X110]
C95  0.1uF/25V  C_CHIP-0805(2012-METRIC)  [CAPC2012X110]
C96  0.1uF/25V  C_CHIP-0805(2012-METRIC)  [CAPC2012X110]
C97  22uF/25V  C_CHIP-0805(2012-METRIC)  [CAPC2012X110]
C98  22uF/25V  C_CHIP-0805(2012-METRIC)  [CAPC2012X110]
C99  0.1uF/25V  C_CHIP-0805(2012-METRIC)  [CAPC2012X110]
C100  0.1uF/25V  C_CHIP-0805(2012-METRIC)  [CAPC2012X110]
C101  0.1uF/25V  C_CHIP-0805(2012-METRIC)  [CAPC2012X110]
C102  0.1uF/25V  C_CHIP-0805(2012-METRIC)  [CAPC2012X110]
C103  22uF/25V  C_CHIP-0805(2012-METRIC)  [CAPC2012X110]
C104  22uF/25V  C_CHIP-0805(2012-METRIC)  [CAPC2012X110]
C105  0.1uF/25V  C_CHIP-0805(2012-METRIC)  [CAPC2012X110]
C106  0.1uF/25V  C_CHIP-0805(2012-METRIC)  [CAPC2012X110]
C107  0.1uF/25V  C_CHIP-0805(2012-METRIC)  [CAPC2012X110]
C108  0.1uF/25V  C_CHIP-0805(2012-METRIC)  [CAPC2012X110]
C109  18pF/50V  C_CHIP-0805(2012-METRIC)  [CAPC2012X110]
C110  18pF/50V  C_CHIP-0805(2012-METRIC)  [CAPC2012X110]
C111  2.2uF/10V  C_CHIP-0805(2012-METRIC)  [CAPC2012X110]
C112  0.1uF/25V  C_CHIP-0805(2012-METRIC)  [CAPC2012X110]
C113  0.1uF/25V  C_CHIP-0805(2012-METRIC)  [CAPC2012X110]
C114  0.1uF/25V  C_CHIP-0805(2012-METRIC)  [CAPC2012X110]
C115  1uF/25V  C_CHIP-0805(2012-METRIC)  [CAPC2012X110]
C116  0.1uF/25V  C_CHIP-0805(2012-METRIC)  [CAPC2012X110]
C117  10UF 10V  C_CHIP-0805(2012-METRIC)  [CAPC2012X110]
C118  1uF/25V  C_CHIP-0805(2012-METRIC)  [CAPC2012X110]
C119  0.1uF/25V  C_CHIP-0805(2012-METRIC)  [CAPC2012X110]
C120  22uF/25V  C_CHIP-0805(2012-METRIC)  [CAPC2012X110]
C121  22uF/25V  C_CHIP-0805(2012-METRIC)  [CAPC2012X110]
C122  0.1uF/25V  C_CHIP-0805(2012-METRIC)  [CAPC2012X110]
C123  0.1uF/25V  C_CHIP-0805(2012-METRIC)  [CAPC2012X110]
C124  0.1uF/25V  C_CHIP-0805(2012-METRIC)  [CAPC2012X110]
C125  1000pF/50V  C_CHIP-0805(2012-METRIC)  [CAPC2012X110]
C126  1000pF/50V  C_CHIP-0805(2012-METRIC)  [CAPC2012X110]
C127  0.1uF/25V  C_CHIP-0805(2012-METRIC)  [CAPC2012X110]
C128  0.1uF/25V  C_CHIP-0805(2012-METRIC)  [CAPC2012X110]
C129  0.1uF/25V  C_CHIP-0805(2012-METRIC)  [CAPC2012X110]
C130  0.1uF/25V  C_CHIP-0805(2012-METRIC)  [CAPC2012X110]
C131  1000pF/50V  C_CHIP-0805(2012-METRIC)  [CAPC2012X110]
C132  1000pF/50V  C_CHIP-0805(2012-METRIC)  [CAPC2012X110]
C133  0.1uF/25V  C_CHIP-0805(2012-METRIC)  [CAPC2012X110]
C134  0.1uF/25V  C_CHIP-0805(2012-METRIC)  [CAPC2012X110]
C135  0.1uF/25V  C_CHIP-0805(2012-METRIC)  [CAPC2012X110]
C136  0.1uF/25V  C_CHIP-0805(2012-METRIC)  [CAPC2012X110]
C137  0.1uF/25V  C_CHIP-0805(2012-METRIC)  [CAPC2012X110]
C138  0.1uF/25V  C_CHIP-0805(2012-METRIC)  [CAPC2012X110]
C139  0.1uF/25V  C_CHIP-0805(2012-METRIC)  [CAPC2012X110]
C140  0.1uF/25V  C_CHIP-0805(2012-METRIC)  [CAPC2012X110]
C141  18pF/50V  C_CHIP-0805(2012-METRIC)  [CAPC2012X110]
C142  18pF/50V  C_CHIP-0805(2012-METRIC)  [CAPC2012X110]
C143  2.2uF/10V  C_CHIP-0805(2012-METRIC)  [CAPC2012X110]
C144  0.1uF/25V  C_CHIP-0805(2012-METRIC)  [CAPC2012X110]
C145  27pF/50V  C_CHIP-0805(2012-METRIC)  [CAPC2012X110]
C146  27pF/50V  C_CHIP-0805(2012-METRIC)  [CAPC2012X110]
C147  0.1uF/25V  C_CHIP-0805(2012-METRIC)  [CAPC2012X110]
C148  0.1uF/25V  C_CHIP-0805(2012-METRIC)  [CAPC2012X110]
C149  0.1uF/25V  C_CHIP-0805(2012-METRIC)  [CAPC2012X110]
C150  0.1uF/25V  C_CHIP-0805(2012-METRIC)  [CAPC2012X110]
C151  0.1uF/25V  C_CHIP-0805(2012-METRIC)  [CAPC2012X110]
C152  22uF/25V  C_CHIP-0805(2012-METRIC)  [CAPC2012X110]
C153  22uF/25V  C_CHIP-0805(2012-METRIC)  [CAPC2012X110]
C154  0.1uF/25V  C_CHIP-0805(2012-METRIC)  [CAPC2012X110]
C155  0.1uF/25V  C_CHIP-0805(2012-METRIC)  [CAPC2012X110]
C156  0.1uF/25V  C_CHIP-0805(2012-METRIC)  [CAPC2012X110]
C157  1000pF/50V  C_CHIP-0805(2012-METRIC)  [CAPC2012X110]
C158  1000pF/50V  C_CHIP-0805(2012-METRIC)  [CAPC2012X110]
C159  0.1uF/25V  C_CHIP-0805(2012-METRIC)  [CAPC2012X110]
C160  0.1uF/25V  C_CHIP-0805(2012-METRIC)  [CAPC2012X110]
C161  0.1uF/25V  C_CHIP-0805(2012-METRIC)  [CAPC2012X110]
C162  0.1uF/25V  C_CHIP-0805(2012-METRIC)  [CAPC2012X110]
C163  1000pF/50V  C_CHIP-0805(2012-METRIC)  [CAPC2012X110]
C164  1000pF/50V  C_CHIP-0805(2012-METRIC)  [CAPC2012X110]
C165  0.1uF/25V  C_CHIP-0805(2012-METRIC)  [CAPC2012X110]
C166  0.1uF/25V  C_CHIP-0805(2012-METRIC)  [CAPC2012X110]
C167  0.1uF/25V  C_CHIP-0805(2012-METRIC)  [CAPC2012X110]
C168  0.1uF/25V  C_CHIP-0805(2012-METRIC)  [CAPC2012X110]
C169  0.1uF/25V  C_CHIP-0805(2012-METRIC)  [CAPC2012X110]
C170  0.1uF/25V  C_CHIP-0805(2012-METRIC)  [CAPC2012X110]
C171  0.1uF/25V  C_CHIP-0805(2012-METRIC)  [CAPC2012X110]
C172  0.1uF/25V  C_CHIP-0805(2012-METRIC)  [CAPC2012X110]
C173  27pF/50V  C_CHIP-0805(2012-METRIC)  [CAPC2012X110]
C174  27pF/50V  C_CHIP-0805(2012-METRIC)  [CAPC2012X110]
C175  0.1uF/25V  C_CHIP-0805(2012-METRIC)  [CAPC2012X110]
C176  0.1uF/25V  C_CHIP-0805(2012-METRIC)  [CAPC2012X110]
C177  0.1uF/25V  C_CHIP-0805(2012-METRIC)  [CAPC2012X110]
C178  0.1uF/25V  C_CHIP-0805(2012-METRIC)  [CAPC2012X110]
C179  10uF/10V  C_CHIP-0805(2012-METRIC)  [CAPC2012X110]
C180  0.1uF/25V  C_CHIP-0805(2012-METRIC)  [CAPC2012X110]
C181  0.1uF/50V  CAP_CERAMIC0805-NOOUTLINE  [0805-NO]
C182  22uF/63V  CAP_ELECTROLYTICPANASONIC_D  [PANASONIC_D]
C183  0.1uF/50V  CAP_CERAMIC0805-NOOUTLINE  [0805-NO]
C184  22uF/63V  CAP_ELECTROLYTICPANASONIC_D  [PANASONIC_D]
C185  0.1uF/50V  CAP_CERAMIC0805-NOOUTLINE  [0805-NO]
C186  22uF/63V  CAP_ELECTROLYTICPANASONIC_D  [PANASONIC_D]
C187  0.1uF/50V  CAP_CERAMIC0805-NOOUTLINE  [0805-NO]
C188  22uF/63V  CAP_ELECTROLYTICPANASONIC_D  [PANASONIC_D]
C189  0.1uF/50V  CAP_CERAMIC0805-NOOUTLINE  [0805-NO]
C190  22uF/63V  CAP_ELECTROLYTICPANASONIC_D  [PANASONIC_D]
C191  0.1uF/50V  CAP_CERAMIC0805-NOOUTLINE  [0805-NO]
C192  22uF/63V  CAP_ELECTROLYTICPANASONIC_D  [PANASONIC_D]
C193  0.1uF/50V  CAP_CERAMIC0805-NOOUTLINE  [0805-NO]
C194  22uF/63V  CAP_ELECTROLYTICPANASONIC_D  [PANASONIC_D]
C195  0.1uF/50V  CAP_CERAMIC0805-NOOUTLINE  [0805-NO]
C196  22uF/63V  CAP_ELECTROLYTICPANASONIC_D  [PANASONIC_D]
C197  0.1uF/50V  CAP_CERAMIC0805-NOOUTLINE  [0805-NO]
C198  22uF/63V  CAP_ELECTROLYTICPANASONIC_D  [PANASONIC_D]
C199  0.1uF/50V  CAP_CERAMIC0805-NOOUTLINE  [0805-NO]
C200  22uF/63V  CAP_ELECTROLYTICPANASONIC_D  [PANASONIC_D]
C201  0.1uF/50V  CAP_CERAMIC0805-NOOUTLINE  [0805-NO]
C202  22uF/63V  CAP_ELECTROLYTICPANASONIC_D  [PANASONIC_D]
C203  0.1uF/50V  CAP_CERAMIC0805-NOOUTLINE  [0805-NO]
C204  22uF/63V  CAP_ELECTROLYTICPANASONIC_D  [PANASONIC_D]
C205  0.1uF/50V  CAP_CERAMIC0805-NOOUTLINE  [0805-NO]
C206  22uF/63V  CAP_ELECTROLYTICPANASONIC_D  [PANASONIC_D]
C207  0.1uF/50V  CAP_CERAMIC0805-NOOUTLINE  [0805-NO]
C208  22uF/63V  CAP_ELECTROLYTICPANASONIC_D  [PANASONIC_D]
C209  0.1uF/50V  CAP_CERAMIC0805-NOOUTLINE  [0805-NO]
C210  22uF/63V  CAP_ELECTROLYTICPANASONIC_D  [PANASONIC_D]
C211  0.1uF/50V  CAP_CERAMIC0805-NOOUTLINE  [0805-NO]
C212  22uF/63V  CAP_ELECTROLYTICPANASONIC_D  [PANASONIC_D]
C213  0.1uF/50V  CAP_CERAMIC0805-NOOUTLINE  [0805-NO]
C214  22uF/63V  CAP_ELECTROLYTICPANASONIC_D  [PANASONIC_D]
C215  0.1uF/50V  CAP_CERAMIC0805-NOOUTLINE  [0805-NO]
C216  0.1uF/50V  CAP_CERAMIC0805-NOOUTLINE  [0805-NO]
C217  0.1uF/50V  CAP_CERAMIC0805-NOOUTLINE  [0805-NO]
C218  0.1uF/50V  CAP_CERAMIC0805-NOOUTLINE  [0805-NO]
C219  0.1uF/50V  CAP_CERAMIC0805-NOOUTLINE  [0805-NO]
C220  0.1uF/50V  CAP_CERAMIC0805-NOOUTLINE  [0805-NO]
C221  0.1uF/50V  CAP_CERAMIC0805-NOOUTLINE  [0805-NO]
C222  0.1uF/50V  CAP_CERAMIC0805-NOOUTLINE  [0805-NO]
C223  0.1uF/50V  CAP_CERAMIC0805-NOOUTLINE  [0805-NO]
C224  0.1uF/50V  CAP_CERAMIC0805-NOOUTLINE  [0805-NO]
C225  0.1uF/50V  CAP_CERAMIC0805-NOOUTLINE  [0805-NO]
C226  0.1uF/50V  CAP_CERAMIC0805-NOOUTLINE  [0805-NO]
C227  0.1uF/50V  CAP_CERAMIC0805-NOOUTLINE  [0805-NO]
C228  0.1uF/50V  CAP_CERAMIC0805-NOOUTLINE  [0805-NO]
C229  0.1uF/50V  CAP_CERAMIC0805-NOOUTLINE  [0805-NO]
C230  0.1uF/50V  CAP_CERAMIC0805-NOOUTLINE  [0805-NO]
C231  0.1uF/50V  CAP_CERAMIC0805-NOOUTLINE  [0805-NO]
C232  0.1uF/50V  CAP_CERAMIC0805-NOOUTLINE  [0805-NO]
C233  0.1uF/50V  CAP_CERAMIC0805-NOOUTLINE  [0805-NO]
C234  0.1uF/50V  CAP_CERAMIC0805-NOOUTLINE  [0805-NO]
C235  0.1uF/50V  CAP_CERAMIC0805-NOOUTLINE  [0805-NO]
C236  0.1uF/50V  CAP_CERAMIC0805-NOOUTLINE  [0805-NO]
C237  0.1uF/50V  CAP_CERAMIC0805-NOOUTLINE  [0805-NO]
C238  0.1uF/50V  CAP_CERAMIC0805-NOOUTLINE  [0805-NO]
C239  0.1uF/50V  CAP_CERAMIC0805-NOOUTLINE  [0805-NO]
C240  0.1uF/50V  CAP_CERAMIC0805-NOOUTLINE  [0805-NO]
C241  0.1uF/50V  CAP_CERAMIC0805-NOOUTLINE  [0805-NO]
C242  0.1uF/50V  CAP_CERAMIC0805-NOOUTLINE  [0805-NO]
C243  0.1uF/50V  CAP_CERAMIC0805-NOOUTLINE  [0805-NO]
C244  0.1uF/50V  CAP_CERAMIC0805-NOOUTLINE  [0805-NO]
C245  0.1uF/50V  CAP_CERAMIC0805-NOOUTLINE  [0805-NO]
C246  0.1uF/50V  CAP_CERAMIC0805-NOOUTLINE  [0805-NO]
C247  0.1uF/50V  CAP_CERAMIC0805-NOOUTLINE  [0805-NO]
C248  0.1uF/50V  CAP_CERAMIC0805-NOOUTLINE  [0805-NO]
C249  4.7uF/6.3V  C_CHIP-0805(2012-METRIC)  [CAPC2012X110]
C250  0.1uF/25V  C_CHIP-0805(2012-METRIC)  [CAPC2012X110]
C251  0.1uF/25V  C_CHIP-0805(2012-METRIC)  [CAPC2012X110]
C252  0.1uF/25V  C_CHIP-0805(2012-METRIC)  [CAPC2012X110]
C253  0.1uF/25V  C_CHIP-0805(2012-METRIC)  [CAPC2012X110]
C254  27pF/50V  C_CHIP-0805(2012-METRIC)  [CAPC2012X110]
C255  27pF/50V  C_CHIP-0805(2012-METRIC)  [CAPC2012X110]
C256  1uF/25V  C_CHIP-0805(2012-METRIC)  [CAPC2012X110]
C257  1uF/25V  C_CHIP-0805(2012-METRIC)  [CAPC2012X110]
C258  4.7uF/6.3V  C_CHIP-0805(2012-METRIC)  [CAPC2012X110]
C259  0.1uF/25V  C_CHIP-0805(2012-METRIC)  [CAPC2012X110]
C260  1000pF/50V  C_CHIP-0805(2012-METRIC)  [CAPC2012X110]
C261  0.1uF/25V  C_CHIP-0805(2012-METRIC)  [CAPC2012X110]
C262  0.1UF 25V  C_CHIP-0805(2012-METRIC)  [CAPC2012X110]
C263  0.1uF/25V  C_CHIP-0805(2012-METRIC)  [CAPC2012X110]
C264  0.1uF/25V  C_CHIP-0805(2012-METRIC)  [CAPC2012X110]
C265  0.1uF/25V  C_CHIP-0805(2012-METRIC)  [CAPC2012X110]
C266  0.1uF/25V  C_CHIP-0805(2012-METRIC)  [CAPC2012X110]
C267  0.1uF/25V  C_CHIP-0805(2012-METRIC)  [CAPC2012X110]
C268  0.1uF/25V  C_CHIP-0805(2012-METRIC)  [CAPC2012X110]
C269  0.1uF/25V  C_CHIP-0805(2012-METRIC)  [CAPC2012X110]
C270  0.1uF/25V  C_CHIP-0805(2012-METRIC)  [CAPC2012X110]
C271  0.1uF/25V  C_CHIP-0805(2012-METRIC)  [CAPC2012X110]
C272  0.1uF/25V  C_CHIP-0805(2012-METRIC)  [CAPC2012X110]
C273  0.1uF/25V  C_CHIP-0805(2012-METRIC)  [CAPC2012X110]
C274  0.1uF/25V  C_CHIP-0805(2012-METRIC)  [CAPC2012X110]
C275  0.1uF/25V  C_CHIP-0805(2012-METRIC)  [CAPC2012X110]
C276  0.1uF/25V  C_CHIP-0805(2012-METRIC)  [CAPC2012X110]
D1  SMAJ16A  [DIOM4325X250N]
D2  LED_BLUE  CHIP-ROUND-B_0603  [LEDC1608X65N_RND-B]
D3  LED_BLUE  CHIP-ROUND-B_0603  [LEDC1608X65N_RND-B]
D4  LED_BLUE  CHIP-ROUND-B_0603  [LEDC1608X65N_RND-B]
D5  LED_BLUE  CHIP-ROUND-B_0603  [LEDC1608X65N_RND-B]
D6  LED_BLUE  CHIP-ROUND-B_0603  [LEDC1608X65N_RND-B]
D7  LED_BLUE  CHIP-ROUND-B_0603  [LEDC1608X65N_RND-B]
D8  LED_BLUE  CHIP-ROUND-B_0603  [LEDC1608X65N_RND-B]
D9  LED_BLUE  CHIP-ROUND-B_0603  [LEDC1608X65N_RND-B]
D10  ZENER-3V3  ZENERDO-214AB(SMC)  [DIOM7959X625N]
D11  ZENER-3V3  ZENERDO-214AB(SMC)  [DIOM7959X625N]
D12  ZENER-3V3  ZENERDO-214AB(SMC)  [DIOM7959X625N]
D13  ZENER-3V3  ZENERDO-214AB(SMC)  [DIOM7959X625N]
D14  ZENER-3V3  ZENERDO-214AB(SMC)  [DIOM7959X625N]
D15  ZENER-3V3  ZENERDO-214AB(SMC)  [DIOM7959X625N]
D16  ZENER-3V3  ZENERDO-214AB(SMC)  [DIOM7959X625N]
D17  ZENER-3V3  ZENERDO-214AB(SMC)  [DIOM7959X625N]
D18  ZENER-3V3  ZENERDO-214AB(SMC)  [DIOM7959X625N]
D19  ZENER-3V3  ZENERDO-214AB(SMC)  [DIOM7959X625N]
D20  ZENER-3V3  ZENERDO-214AB(SMC)  [DIOM7959X625N]
D21  ZENER-3V3  ZENERDO-214AB(SMC)  [DIOM7959X625N]
D22  ZENER-3V3  ZENERDO-214AB(SMC)  [DIOM7959X625N]
D23  ZENER-3V3  ZENERDO-214AB(SMC)  [DIOM7959X625N]
D24  ZENER-3V3  ZENERDO-214AB(SMC)  [DIOM7959X625N]
D25  ZENER-3V3  ZENERDO-214AB(SMC)  [DIOM7959X625N]
D26  ZENER-3V3  ZENERDO-214AB(SMC)  [DIOM7959X625N]
D27  ZENER-3V3  ZENERDO-214AB(SMC)  [DIOM7959X625N]
D28  ZENER-3V3  ZENERDO-214AB(SMC)  [DIOM7959X625N]
D29  ZENER-3V3  ZENERDO-214AB(SMC)  [DIOM7959X625N]
D30  ZENER-3V3  ZENERDO-214AB(SMC)  [DIOM7959X625N]
D31  ZENER-3V3  ZENERDO-214AB(SMC)  [DIOM7959X625N]
D32  ZENER-3V3  ZENERDO-214AB(SMC)  [DIOM7959X625N]
D33  ZENER-3V3  ZENERDO-214AB(SMC)  [DIOM7959X625N]
D34  ZENER-3V3  ZENERDO-214AB(SMC)  [DIOM7959X625N]
D35  ZENER-3V3  ZENERDO-214AB(SMC)  [DIOM7959X625N]
D36  ZENER-3V3  ZENERDO-214AB(SMC)  [DIOM7959X625N]
D37  ZENER-3V3  ZENERDO-214AB(SMC)  [DIOM7959X625N]
D38  ZENER-3V3  ZENERDO-214AB(SMC)  [DIOM7959X625N]
D39  ZENER-3V3  ZENERDO-214AB(SMC)  [DIOM7959X625N]
D40  ZENER-3V3  ZENERDO-214AB(SMC)  [DIOM7959X625N]
D41  ZENER-3V3  ZENERDO-214AB(SMC)  [DIOM7959X625N]
D42  ZENER-3V3  ZENERDO-214AB(SMC)  [DIOM7959X625N]
D43  ZENER-3V3  ZENERDO-214AB(SMC)  [DIOM7959X625N]
F1  35683568_KEY  [3568_KEY]
FB1  FERRITE-600  FBCHIP-0805(2012-METRIC)  [BEADC2012X105N]
FB2  FERRITE-600  FBCHIP-0805(2012-METRIC)  [BEADC2012X105N]
FB3  FERRITE-220  FBCHIP-0805(2012-METRIC)  [BEADC2012X105N]
FB4  FERRITE-220  FBCHIP-0805(2012-METRIC)  [BEADC2012X105N]
FR_STEER  DF11-6DP-2DS(52)CON6_2X3_RF_DF11  [CON6_2X3_RF_DF11]
FR_WHEEL  DF11-6DP-2DS(52)CON6_2X3_RF_DF11  [CON6_2X3_RF_DF11]
H1  9774050960R  [9774050960R]
H2  9774050960R  [9774050960R]
H3  9774050960R  [9774050960R]
H4  9774050960R  [9774050960R]
IC1  IRFHS8342TRPBF  [PQFN(2X2)]
IC2  PI4MSD5V9546ALEX  [SOP65P640X120-16N]
IC3  MP62341DH-LF-Z  [SOP65P490X110-9N]
IC4  MP62341DH-LF-Z  [SOP65P490X110-9N]
J1  ZX62D-AB-5P8(30)  [HRS_ZX62D-AB-5P8(30)]
J2  878325622CONN_87832-5622_MOL  [CONN_87832-5622_MOL]
J3  GSB311231HRGSB311231HR_AMP  [GSB311231HR_AMP]
J4  GSB311231HRGSB311231HR_AMP  [GSB311231HR_AMP]
J5  XT60-M  [AMASS_XT60-M]
J6  I2C Qwiic Connector  QWIIC_CONNECTORJS-1MM  [1X04_1MM_RA]
J7  5025700893502570-0893_MOL  [502570-0893_MOL]
J11  DF11-6DP-2DS(52)CON6_2X3_RF_DF11  [CON6_2X3_RF_DF11]
J12  DF11-6DP-2DS(52)CON6_2X3_RF_DF11  [CON6_2X3_RF_DF11]
J16  DF11-6DP-2DS(52)CON6_2X3_RF_DF11  [CON6_2X3_RF_DF11]
J17  DF11-6DP-2DS(52)CON6_2X3_RF_DF11  [CON6_2X3_RF_DF11]
J18  DF11-6DP-2DS(52)CON6_2X3_RF_DF11  [CON6_2X3_RF_DF11]
J19  DF11-6DP-2DS(52)CON6_2X3_RF_DF11  [CON6_2X3_RF_DF11]
J20  DF11-6DP-2DS(52)CON6_2X3_RF_DF11  [CON6_2X3_RF_DF11]
J21  DF11-6DP-2DS(52)CON6_2X3_RF_DF11  [CON6_2X3_RF_DF11]
J30  FEMALE 2x3  DF11-6DP-2DS(52)CON6_2X3_RF_DF11  [CON6_2X3_RF_DF11]
J36  DF11-6DP-2DS(52)CON6_2X3_RF_DF11  [CON6_2X3_RF_DF11]
J37  DF11-6DP-2DS(52)CON6_2X3_RF_DF11  [CON6_2X3_RF_DF11]
J38  DF11-6DP-2DS(52)CON6_2X3_RF_DF11  [CON6_2X3_RF_DF11]
JP1  PINHD-2X6/90  [2X06/90]
JP2  PINHD-2X6/90  [2X06/90]
L1  1.2uH  L_CHIP-1206(3216-METRIC)  [INDC3216X190]
MR_WHEEL  DF11-6DP-2DS(52)CON6_2X3_RF_DF11  [CON6_2X3_RF_DF11]
PWR  2828XX-2282834-2  [TERMBLK_254-2N]
Q1  DMN26D0UFB4-7  [TRXDFN100X60X40-3N]
Q2  DMN26D0UFB4-7  [TRXDFN100X60X40-3N]
Q3  DMN26D0UFB4-7  [TRXDFN100X60X40-3N]
Q4  DMN26D0UFB4-7  [TRXDFN100X60X40-3N]
Q5  DMN26D0UFB4-7  [TRXDFN100X60X40-3N]
Q6  DMN26D0UFB4-7  [TRXDFN100X60X40-3N]
Q7  DMN26D0UFB4-7  [TRXDFN100X60X40-3N]
Q8  DMN26D0UFB4-7  [TRXDFN100X60X40-3N]
Q9  DMN26D0UFB4-7  [TRXDFN100X60X40-3N]
Q10  DMN26D0UFB4-7  [TRXDFN100X60X40-3N]
Q11  DMN26D0UFB4-7  [TRXDFN100X60X40-3N]
Q12  DMN26D0UFB4-7  [TRXDFN100X60X40-3N]
R1  0  0OHM-0603-1/10W-5%  [0603]
R2  200K  R-US_CHIP-1206(3216-METRIC)  [RESC3216X70]
R3  499  R-US_CHIP-0805(2012-METRIC)  [RESC2012X65]
R4  499  R-US_CHIP-0805(2012-METRIC)  [RESC2012X65]
R5  NA  R-US_CHIP-0805(2012-METRIC)  [RESC2012X65]
R6  499  R-US_CHIP-0805(2012-METRIC)  [RESC2012X65]
R7  10k  R-US_CHIP-0805(2012-METRIC)  [RESC2012X65]
R8  NA  R-US_CHIP-0805(2012-METRIC)  [RESC2012X65]
R9  422  R-US_CHIP-0805(2012-METRIC)  [RESC2012X65]
R10  274K  R-US_CHIP-0805(2012-METRIC)  [RESC2012X65]
R11  300K  R-US_CHIP-0805(2012-METRIC)  [RESC2012X65]
R12  NA  R-US_CHIP-0805(2012-METRIC)  [RESC2012X65]
R13  0  R-US_CHIP-0805(2012-METRIC)  [RESC2012X65]
R14  20K  R-US_CHIP-0805(2012-METRIC)  [RESC2012X65]
R15  1K  R-US_CHIP-0805(2012-METRIC)  [RESC2012X65]
R16  2.7K  R-US_CHIP-0805(2012-METRIC)  [RESC2012X65]
R17  100K  R-US_CHIP-0805(2012-METRIC)  [RESC2012X65]
R18  100K  R-US_CHIP-0805(2012-METRIC)  [RESC2012X65]
R19  56.2K  R-US_CHIP-0805(2012-METRIC)  [RESC2012X65]
R20  10K  R-US_CHIP-0805(2012-METRIC)  [RESC2012X65]
R21  40.2K  R-US_CHIP-0805(2012-METRIC)  [RESC2012X65]
R22  40.2K  R-US_CHIP-0805(2012-METRIC)  [RESC2012X65]
R23  68K  R-US_CHIP-0805(2012-METRIC)  [RESC2012X65]
R24  34K  R-US_CHIP-0805(2012-METRIC)  [RESC2012X65]
R25  200K  R-US_CHIP-0805(2012-METRIC)  [RESC2012X65]
R26  44.2K  R-US_CHIP-0805(2012-METRIC)  [RESC2012X65]
R27  100K  R-US_CHIP-0805(2012-METRIC)  [RESC2012X65]
R28  100K  R-US_CHIP-0805(2012-METRIC)  [RESC2012X65]
R29  200K  R-US_CHIP-0805(2012-METRIC)  [RESC2012X65]
R30  100K  R-US_CHIP-0805(2012-METRIC)  [RESC2012X65]
R31  200K  R-US_CHIP-0805(2012-METRIC)  [RESC2012X65]
R32  44.2K  R-US_CHIP-0805(2012-METRIC)  [RESC2012X65]
R33  68K  R-US_CHIP-0805(2012-METRIC)  [RESC2012X65]
R34  12.7K  R-US_CHIP-0805(2012-METRIC)  [RESC2012X65]
R35  56.2K  R-US_CHIP-0805(2012-METRIC)  [RESC2012X65]
R36  10K  R-US_CHIP-0805(2012-METRIC)  [RESC2012X65]
R37  100K  R-US_CHIP-0805(2012-METRIC)  [RESC2012X65]
R38  100K  R-US_CHIP-0805(2012-METRIC)  [RESC2012X65]
R39  100K  R-US_CHIP-0805(2012-METRIC)  [RESC2012X65]
R40  100K  R-US_CHIP-0805(2012-METRIC)  [RESC2012X65]
R41  10K  R-US_CHIP-0805(2012-METRIC)  [RESC2012X65]
R42  10K  R-US_CHIP-0805(2012-METRIC)  [RESC2012X65]
R43  10K  R-US_CHIP-0805(2012-METRIC)  [RESC2012X65]
R44  0  R-US_CHIP-0805(2012-METRIC)  [RESC2012X65]
R45  10K  R-US_CHIP-0805(2012-METRIC)  [RESC2012X65]
R46  10K  R-US_CHIP-0805(2012-METRIC)  [RESC2012X65]
R47  10K  R-US_CHIP-0805(2012-METRIC)  [RESC2012X65]
R48  10K  R-US_CHIP-0805(2012-METRIC)  [RESC2012X65]
R49  1K  R-US_CHIP-0805(2012-METRIC)  [RESC2012X65]
R50  12K  R-US_CHIP-0805(2012-METRIC)  [RESC2012X65]
R51  10K  R-US_CHIP-0805(2012-METRIC)  [RESC2012X65]
R52  2K  R-US_CHIP-0805(2012-METRIC)  [RESC2012X65]
R53  10K  R-US_CHIP-0805(2012-METRIC)  [RESC2012X65]
R54  10K  R-US_CHIP-0805(2012-METRIC)  [RESC2012X65]
R55  10K  R-US_CHIP-0805(2012-METRIC)  [RESC2012X65]
R56  200K  R-US_CHIP-0805(2012-METRIC)  [RESC2012X65]
R57  2.21K  R-US_CHIP-0805(2012-METRIC)  [RESC2012X65]
R58  2.21K  R-US_CHIP-0805(2012-METRIC)  [RESC2012X65]
R59  1K  R-US_CHIP-0805(2012-METRIC)  [RESC2012X65]
R60  10K  R-US_CHIP-0805(2012-METRIC)  [RESC2012X65]
R61  4.7K  R-US_CHIP-0805(2012-METRIC)  [RESC2012X65]
R62  4.7K  R-US_CHIP-0805(2012-METRIC)  [RESC2012X65]
R63  4.7K  R-US_CHIP-0805(2012-METRIC)  [RESC2012X65]
R64  4.7K  R-US_CHIP-0805(2012-METRIC)  [RESC2012X65]
R65  1K  R-US_CHIP-0805(2012-METRIC)  [RESC2012X65]
R66  1K  R-US_CHIP-0805(2012-METRIC)  [RESC2012X65]
R67  2.21k  R-US_CHIP-0805(2012-METRIC)  [RESC2012X65]
R68  2.21k  R-US_CHIP-0805(2012-METRIC)  [RESC2012X65]
R69  10K  R-US_CHIP-0805(2012-METRIC)  [RESC2012X65]
R70  1M  R-US_CHIP-0805(2012-METRIC)  [RESC2012X65]
R71  8.06K  R-US_CHIP-0805(2012-METRIC)  [RESC2012X65]
R72  10K  R-US_CHIP-0805(2012-METRIC)  [RESC2012X65]
R73  0  R-US_CHIP-0805(2012-METRIC)  [RESC2012X65]
R74  12K  R-US_CHIP-0805(2012-METRIC)  [RESC2012X65]
R75  10K  R-US_CHIP-0805(2012-METRIC)  [RESC2012X65]
R76  200K  R-US_CHIP-0805(2012-METRIC)  [RESC2012X65]
R77  200K  R-US_CHIP-0805(2012-METRIC)  [RESC2012X65]
R78  10K  R-US_CHIP-0805(2012-METRIC)  [RESC2012X65]
R79  10K  R-US_CHIP-0805(2012-METRIC)  [RESC2012X65]
R80  10K  R-US_CHIP-0805(2012-METRIC)  [RESC2012X65]
R81  1M  R-US_CHIP-0805(2012-METRIC)  [RESC2012X65]
R82  8.06K  R-US_CHIP-0805(2012-METRIC)  [RESC2012X65]
R83  10K  R-US_CHIP-0805(2012-METRIC)  [RESC2012X65]
R84  0  R-US_CHIP-0805(2012-METRIC)  [RESC2012X65]
R85  12K  R-US_CHIP-0805(2012-METRIC)  [RESC2012X65]
R86  10K  R-US_CHIP-0805(2012-METRIC)  [RESC2012X65]
R87  200K  R-US_CHIP-0805(2012-METRIC)  [RESC2012X65]
R88  200K  R-US_CHIP-0805(2012-METRIC)  [RESC2012X65]
R89  10K  R-US_CHIP-0805(2012-METRIC)  [RESC2012X65]
R90  10K  R-US_CHIP-0805(2012-METRIC)  [RESC2012X65]
R91  10K  R-US_CHIP-0805(2012-METRIC)  [RESC2012X65]
R92  10K  R-US_CHIP-0805(2012-METRIC)  [RESC2012X65]
R93  261  R-US_CHIP-0805(2012-METRIC)  [RESC2012X65]
R94  261  R-US_CHIP-0805(2012-METRIC)  [RESC2012X65]
R95  261  R-US_CHIP-0805(2012-METRIC)  [RESC2012X65]
R96  261  R-US_CHIP-0805(2012-METRIC)  [RESC2012X65]
R97  261  R-US_CHIP-0805(2012-METRIC)  [RESC2012X65]
R98  261  R-US_CHIP-0805(2012-METRIC)  [RESC2012X65]
R99  261  R-US_CHIP-0805(2012-METRIC)  [RESC2012X65]
R100  100K  R-US_CHIP-0805(2012-METRIC)  [RESC2012X65]
R101  261  R-US_CHIP-0805(2012-METRIC)  [RESC2012X65]
R102  100K  R-US_CHIP-0805(2012-METRIC)  [RESC2012X65]
R103  0  R-US_CHIP-0805(2012-METRIC)  [RESC2012X65]
R104  270  R-US_CHIP-1206(3216-METRIC)  [RESC3216X70]
R105  0  R-US_CHIP-0805(2012-METRIC)  [RESC2012X65]
R106  0  R-US_CHIP-0805(2012-METRIC)  [RESC2012X65]
R107  0  R-US_CHIP-0805(2012-METRIC)  [RESC2012X65]
R108  0  R-US_CHIP-0805(2012-METRIC)  [RESC2012X65]
R109  270  R-US_CHIP-1206(3216-METRIC)  [RESC3216X70]
R110  0  R-US_CHIP-0805(2012-METRIC)  [RESC2012X65]
R111  0  R-US_CHIP-0805(2012-METRIC)  [RESC2012X65]
R112  0  R-US_CHIP-0805(2012-METRIC)  [RESC2012X65]
R113  0  R-US_CHIP-0805(2012-METRIC)  [RESC2012X65]
R114  270  R-US_CHIP-1206(3216-METRIC)  [RESC3216X70]
R115  0  R-US_CHIP-0805(2012-METRIC)  [RESC2012X65]
R116  0  R-US_CHIP-0805(2012-METRIC)  [RESC2012X65]
R117  0  R-US_CHIP-0805(2012-METRIC)  [RESC2012X65]
R118  0  R-US_CHIP-0805(2012-METRIC)  [RESC2012X65]
R119  270  R-US_CHIP-1206(3216-METRIC)  [RESC3216X70]
R120  0  R-US_CHIP-0805(2012-METRIC)  [RESC2012X65]
R121  0  R-US_CHIP-0805(2012-METRIC)  [RESC2012X65]
R122  0  R-US_CHIP-0805(2012-METRIC)  [RESC2012X65]
R123  100K  R-US_CHIP-0805(2012-METRIC)  [RESC2012X65]
R124  10K  R-US_CHIP-0805(2012-METRIC)  [RESC2012X65]
R125  270  R-US_CHIP-1206(3216-METRIC)  [RESC3216X70]
R126  30k  R-US_CHIP-1206(3216-METRIC)  [RESC3216X70]
R127  30k  R-US_CHIP-1206(3216-METRIC)  [RESC3216X70]
R128  30k  R-US_CHIP-1206(3216-METRIC)  [RESC3216X70]
R129  30k  R-US_CHIP-1206(3216-METRIC)  [RESC3216X70]
R130  30k  R-US_CHIP-1206(3216-METRIC)  [RESC3216X70]
R131  30k  R-US_CHIP-1206(3216-METRIC)  [RESC3216X70]
R132  30k  R-US_CHIP-1206(3216-METRIC)  [RESC3216X70]
R133  30k  R-US_CHIP-1206(3216-METRIC)  [RESC3216X70]
R134  30k  R-US_CHIP-1206(3216-METRIC)  [RESC3216X70]
R135  30k  R-US_CHIP-1206(3216-METRIC)  [RESC3216X70]
R136  30k  R-US_CHIP-1206(3216-METRIC)  [RESC3216X70]
R137  30k  R-US_CHIP-1206(3216-METRIC)  [RESC3216X70]
R138  30k  R-US_CHIP-1206(3216-METRIC)  [RESC3216X70]
R139  30k  R-US_CHIP-1206(3216-METRIC)  [RESC3216X70]
R140  30k  R-US_CHIP-1206(3216-METRIC)  [RESC3216X70]
R141  30k  R-US_CHIP-1206(3216-METRIC)  [RESC3216X70]
R142  30k  R-US_CHIP-1206(3216-METRIC)  [RESC3216X70]
R143  270  R-US_CHIP-1206(3216-METRIC)  [RESC3216X70]
R144  270  R-US_CHIP-1206(3216-METRIC)  [RESC3216X70]
R145  270  R-US_CHIP-1206(3216-METRIC)  [RESC3216X70]
R146  270  R-US_CHIP-1206(3216-METRIC)  [RESC3216X70]
R147  270  R-US_CHIP-1206(3216-METRIC)  [RESC3216X70]
R148  270  R-US_CHIP-1206(3216-METRIC)  [RESC3216X70]
R149  270  R-US_CHIP-1206(3216-METRIC)  [RESC3216X70]
R150  270  R-US_CHIP-1206(3216-METRIC)  [RESC3216X70]
R151  270  R-US_CHIP-1206(3216-METRIC)  [RESC3216X70]
R152  270  R-US_CHIP-1206(3216-METRIC)  [RESC3216X70]
R153  270  R-US_CHIP-1206(3216-METRIC)  [RESC3216X70]
R154  270  R-US_CHIP-1206(3216-METRIC)  [RESC3216X70]
R155  270  R-US_CHIP-1206(3216-METRIC)  [RESC3216X70]
R156  270  R-US_CHIP-1206(3216-METRIC)  [RESC3216X70]
R157  270  R-US_CHIP-1206(3216-METRIC)  [RESC3216X70]
R158  270  R-US_CHIP-1206(3216-METRIC)  [RESC3216X70]
R159  270  R-US_CHIP-1206(3216-METRIC)  [RESC3216X70]
R160  270  R-US_CHIP-1206(3216-METRIC)  [RESC3216X70]
R161  270  R-US_CHIP-1206(3216-METRIC)  [RESC3216X70]
R162  270  R-US_CHIP-1206(3216-METRIC)  [RESC3216X70]
R163  270  R-US_CHIP-1206(3216-METRIC)  [RESC3216X70]
R164  270  R-US_CHIP-1206(3216-METRIC)  [RESC3216X70]
R165  270  R-US_CHIP-1206(3216-METRIC)  [RESC3216X70]
R166  270  R-US_CHIP-1206(3216-METRIC)  [RESC3216X70]
R167  270  R-US_CHIP-1206(3216-METRIC)  [RESC3216X70]
R168  270  R-US_CHIP-1206(3216-METRIC)  [RESC3216X70]
R169  270  R-US_CHIP-1206(3216-METRIC)  [RESC3216X70]
R170  270  R-US_CHIP-1206(3216-METRIC)  [RESC3216X70]
R171  270  R-US_CHIP-1206(3216-METRIC)  [RESC3216X70]
R172  200K  R-US_CHIP-1206(3216-METRIC)  [RESC3216X70]
R173  200K  R-US_CHIP-1206(3216-METRIC)  [RESC3216X70]
R174  100K  R-US_CHIP-0805(2012-METRIC)  [RESC2012X65]
R175  200K  R-US_CHIP-1206(3216-METRIC)  [RESC3216X70]
R176  200K  R-US_CHIP-1206(3216-METRIC)  [RESC3216X70]
R177  2k  R-US_CHIP-1206(3216-METRIC)  [RESC3216X70]
R178  2k  R-US_CHIP-1206(3216-METRIC)  [RESC3216X70]
R179  2k  R-US_CHIP-1206(3216-METRIC)  [RESC3216X70]
R180  2k  R-US_CHIP-1206(3216-METRIC)  [RESC3216X70]
R181  2k  R-US_CHIP-1206(3216-METRIC)  [RESC3216X70]
R182  2k  R-US_CHIP-1206(3216-METRIC)  [RESC3216X70]
R183  2k  R-US_CHIP-1206(3216-METRIC)  [RESC3216X70]
R184  2k  R-US_CHIP-1206(3216-METRIC)  [RESC3216X70]
R185  2k  R-US_CHIP-1206(3216-METRIC)  [RESC3216X70]
R186  2k  R-US_CHIP-1206(3216-METRIC)  [RESC3216X70]
R187  2k  R-US_CHIP-1206(3216-METRIC)  [RESC3216X70]
R188  2k  R-US_CHIP-1206(3216-METRIC)  [RESC3216X70]
R189  2k  R-US_CHIP-1206(3216-METRIC)  [RESC3216X70]
R190  2k  R-US_CHIP-1206(3216-METRIC)  [RESC3216X70]
R191  2k  R-US_CHIP-1206(3216-METRIC)  [RESC3216X70]
R192  2k  R-US_CHIP-1206(3216-METRIC)  [RESC3216X70]
R193  2k  R-US_CHIP-1206(3216-METRIC)  [RESC3216X70]
R194  2k  R-US_CHIP-1206(3216-METRIC)  [RESC3216X70]
R195  2k  R-US_CHIP-1206(3216-METRIC)  [RESC3216X70]
R196  2k  R-US_CHIP-1206(3216-METRIC)  [RESC3216X70]
R197  2k  R-US_CHIP-1206(3216-METRIC)  [RESC3216X70]
R198  2k  R-US_CHIP-1206(3216-METRIC)  [RESC3216X70]
R199  2k  R-US_CHIP-1206(3216-METRIC)  [RESC3216X70]
R200  2k  R-US_CHIP-1206(3216-METRIC)  [RESC3216X70]
R201  2k  R-US_CHIP-1206(3216-METRIC)  [RESC3216X70]
R202  2k  R-US_CHIP-1206(3216-METRIC)  [RESC3216X70]
R203  2k  R-US_CHIP-1206(3216-METRIC)  [RESC3216X70]
R204  2k  R-US_CHIP-1206(3216-METRIC)  [RESC3216X70]
R205  2k  R-US_CHIP-1206(3216-METRIC)  [RESC3216X70]
R206  2k  R-US_CHIP-1206(3216-METRIC)  [RESC3216X70]
R207  2k  R-US_CHIP-1206(3216-METRIC)  [RESC3216X70]
R208  2k  R-US_CHIP-1206(3216-METRIC)  [RESC3216X70]
R209  2k  R-US_CHIP-1206(3216-METRIC)  [RESC3216X70]
R210  2k  R-US_CHIP-1206(3216-METRIC)  [RESC3216X70]
R211  0  R-US_CHIP-0805(2012-METRIC)  [RESC2012X65]
R212  0  R-US_CHIP-0805(2012-METRIC)  [RESC2012X65]
R213  4.7K  R-US_CHIP-0805(2012-METRIC)  [RESC2012X65]
R214  4.7K  R-US_CHIP-0805(2012-METRIC)  [RESC2012X65]
R215  12K  R-US_CHIP-0805(2012-METRIC)  [RESC2012X65]
R216  10K  R-US_CHIP-0805(2012-METRIC)  [RESC2012X65]
R217  10K  R-US_CHIP-0805(2012-METRIC)  [RESC2012X65]
R218  10K  R-US_CHIP-0805(2012-METRIC)  [RESC2012X65]
R219  1M  R-US_CHIP-0805(2012-METRIC)  [RESC2012X65]
R220  2.21K  R-US_CHIP-0805(2012-METRIC)  [RESC2012X65]
R221  30  R-US_CHIP-0805(2012-METRIC)  [RESC2012X65]
R222  30  R-US_CHIP-0805(2012-METRIC)  [RESC2012X65]
R223  30  R-US_CHIP-0805(2012-METRIC)  [RESC2012X65]
R224  30  R-US_CHIP-0805(2012-METRIC)  [RESC2012X65]
R225  30  R-US_CHIP-0805(2012-METRIC)  [RESC2012X65]
R226  30  R-US_CHIP-0805(2012-METRIC)  [RESC2012X65]
R227  100K  R-US_CHIP-0805(2012-METRIC)  [RESC2012X65]
R228  4.70K  R-US_CHIP-0805(2012-METRIC)  [RESC2012X65]
R229  200K  R-US_CHIP-1206(3216-METRIC)  [RESC3216X70]
R230  200K  R-US_CHIP-1206(3216-METRIC)  [RESC3216X70]
R231  200K  R-US_CHIP-1206(3216-METRIC)  [RESC3216X70]
R232  200K  R-US_CHIP-1206(3216-METRIC)  [RESC3216X70]
R233  200K  R-US_CHIP-1206(3216-METRIC)  [RESC3216X70]
R234  200K  R-US_CHIP-1206(3216-METRIC)  [RESC3216X70]
R235  200K  R-US_CHIP-1206(3216-METRIC)  [RESC3216X70]
R236  200K  R-US_CHIP-1206(3216-METRIC)  [RESC3216X70]
R237  200K  R-US_CHIP-1206(3216-METRIC)  [RESC3216X70]
R238  200K  R-US_CHIP-1206(3216-METRIC)  [RESC3216X70]
R239  200K  R-US_CHIP-1206(3216-METRIC)  [RESC3216X70]
R240  200K  R-US_CHIP-1206(3216-METRIC)  [RESC3216X70]
RR_STEER  DF11-6DP-2DS(52)CON6_2X3_RF_DF11  [CON6_2X3_RF_DF11]
RR_WHEEL  DF11-6DP-2DS(52)CON6_2X3_RF_DF11  [CON6_2X3_RF_DF11]
S1  B3U-1000P(M)-B  B3U-X000B3U-1000P(M)-B1000P(M)-B  [B3U-1000P(M)-B]
S2  500SSP1S1M6QEA  [SW_500SSP1S1M6QEA]
U1  SM-K26-XCL2GI  [MODULE_SM-K26-XCL2GI]
U2  MP5016GQH-Z  [IC_MP5016GQH-Z]
U3  MP8772GQ-Z  [CONV_MP8772GQ-Z]
U4  INA260AIPWR  [SOP65P640X120-16N]
U5  MP8904DD-LF-Z  [VREG_MP8904DD-LF-Z]
U6  MPM3810AGQB-AEC1-ZQFN2P5X3P0X0P9_MNP  [QFN2P5X3P0X0P9_MNP]
U7  MPM3810AGQB-AEC1-ZQFN2P5X3P0X0P9_MNP  [QFN2P5X3P0X0P9_MNP]
U8  MPM3840GQV-Z  [CONV_MPM3840GQV-Z]
U9  MPM3840GQV-Z  [CONV_MPM3840GQV-Z]
U10  MPM3840GQV-Z  [CONV_MPM3840GQV-Z]
U11  MPM3810AGQB-AEC1-ZQFN2P5X3P0X0P9_MNP  [QFN2P5X3P0X0P9_MNP]
U12  MP8904DD-LF-Z  [VREG_MP8904DD-LF-Z]
U13  SN74AVC2T245RSWR  [QFN40P180X140X55-10N]
U14  SN74AVC4T245RSVR  [QFN40P260X180X55-16N]
U15  SN74LVC2G07DCKT  [SOT65P210X110-6N]
U16  SN74AVC2T245RSWR  [QFN40P180X140X55-10N]
U17  SN74AVC2T245RSWR  [QFN40P180X140X55-10N]
U18  FT4232HL  [QFP50P1200X1200X160-64N]
U19  TPD4S012DRYRDRY6  [DRY6]
U20  PCA9306DCTRDCT8-L  [DCT8-L]
U21  M24C64-DRDW8TP/KTSSOP8_4P5X3P1X0P65_STM-L  [TSSOP8_4P5X3P1X0P65_STM-L]
U22  M24C64-DRDW8TP/KTSSOP8_4P5X3P1X0P65_STM-L  [TSSOP8_4P5X3P1X0P65_STM-L]
U23  M24C64-DRDW8TP/KTSSOP8_4P5X3P1X0P65_STM-L  [TSSOP8_4P5X3P1X0P65_STM-L]
U24  TPD4S012DRYRDRY6  [DRY6]
U25  TPD4E05U06DQARDQA0010A  [DQA0010A]
U26  TPD4S012DRYRDRY6  [DRY6]
U27  TPD4E05U06DQARDQA0010A  [DQA0010A]
U28  TPD4S012DRYRDRY6  [DRY6]
U29  TPD4E05U06DQARDQA0010A  [DQA0010A]
U30  TPD4S012DRYRDRY6  [DRY6]
U31  TPD4E05U06DQARDQA0010A  [DQA0010A]
U32  USB3320C-EZK-TR  [QFN50P500X500X100-33N330X330]
U33  USB5744/2G  [QFN40P700X700X100-57N]
U34  USB3320C-EZK-TR  [QFN50P500X500X100-33N330X330]
U35  USB5744/2G  [QFN40P700X700X100-57N]
U36  STMPS2161STRSOT_161STR_STM-L  [SOT_161STR_STM-L]
U37  DRV8871  [HSOP8]
U38  DRV8871  [HSOP8]
U39  DRV8871  [HSOP8]
U40  DRV8871  [HSOP8]
U41  DRV8871  [HSOP8]
U42  DRV8871  [HSOP8]
U43  DRV8871  [HSOP8]
U44  DRV8871  [HSOP8]
U45  DRV8871  [HSOP8]
U46  DRV8871  [HSOP8]
U47  DRV8871  [HSOP8]
U48  DRV8871  [HSOP8]
U49  DRV8871  [HSOP8]
U50  DRV8871  [HSOP8]
U51  DRV8871  [HSOP8]
U52  DRV8871  [HSOP8]
U53  DRV8871  [HSOP8]
U54  USB2244-AEZG-06QFN36_6X6MC_MCH-L  [QFN36_6X6MC_MCH-L]
U55  TPD6E004RSERRSE8  [RSE8]
U56  LSF0102DQERDQE0008A  [DQE0008A]
U57  LSF0102DQERDQE0008A  [DQE0008A]
U58  LSF0102DQERDQE0008A  [DQE0008A]
U59  STMPS2161STRSOT_161STR_STM-L  [SOT_161STR_STM-L]
U60  LSF0102DQERDQE0008A  [DQE0008A]
U61  LSF0102DQERDQE0008A  [DQE0008A]
U62  LSF0102DQERDQE0008A  [DQE0008A]
U63  LSF0102DQERDQE0008A  [DQE0008A]
U64  LSF0102DQERDQE0008A  [DQE0008A]
U65  LSF0102DQERDQE0008A  [DQE0008A]
U66  LSF0102DQERDQE0008A  [DQE0008A]
U67  LSF0102DQERDQE0008A  [DQE0008A]
U68  LSF0102DQERDQE0008A  [DQE0008A]
U69  LSF0102DQERDQE0008A  [DQE0008A]
U70  LSF0102DQERDQE0008A  [DQE0008A]
U71  LSF0102DQERDQE0008A  [DQE0008A]
U72  LSF0102DQERDQE0008A  [DQE0008A]
U73  LSF0102DQERDQE0008A  [DQE0008A]
U$1  93LC56BT-I/SN  [SOIC127P600X175-8N]
U$85  D36V50F12  [D36V50F12]
Y1  ECS-120-18-33-JGN-TR  [XTAL_ECS-120-18-33-JGN-TR]
Y2  TSX-3225_16.0000MF09Z-AC3  [TSX-3225_2]
Y3  ECS-240-18-33-JGN-TR  [XTAL_ECS-240-18-33-JGN-TR]
Y4  TSX-3225_16.0000MF09Z-AC3  [TSX-3225_2]
Y5  RH100-25.00-18-F-3030-TR  [RH100-25.00-18-F-3030-TR]
Y6  RH100-25.00-18-F-3030-TR  [RH100-25.00-18-F-3030-TR]